# Altium project DMPro16.PrjPcb (part 2 of 3)

## Sheet XC7A35TFTG256_bank35.SchDoc
size A4; DocumentNumber: 20; SheetNumber: 20; SheetTotal: 21; SheetName: FPGA Bank 35
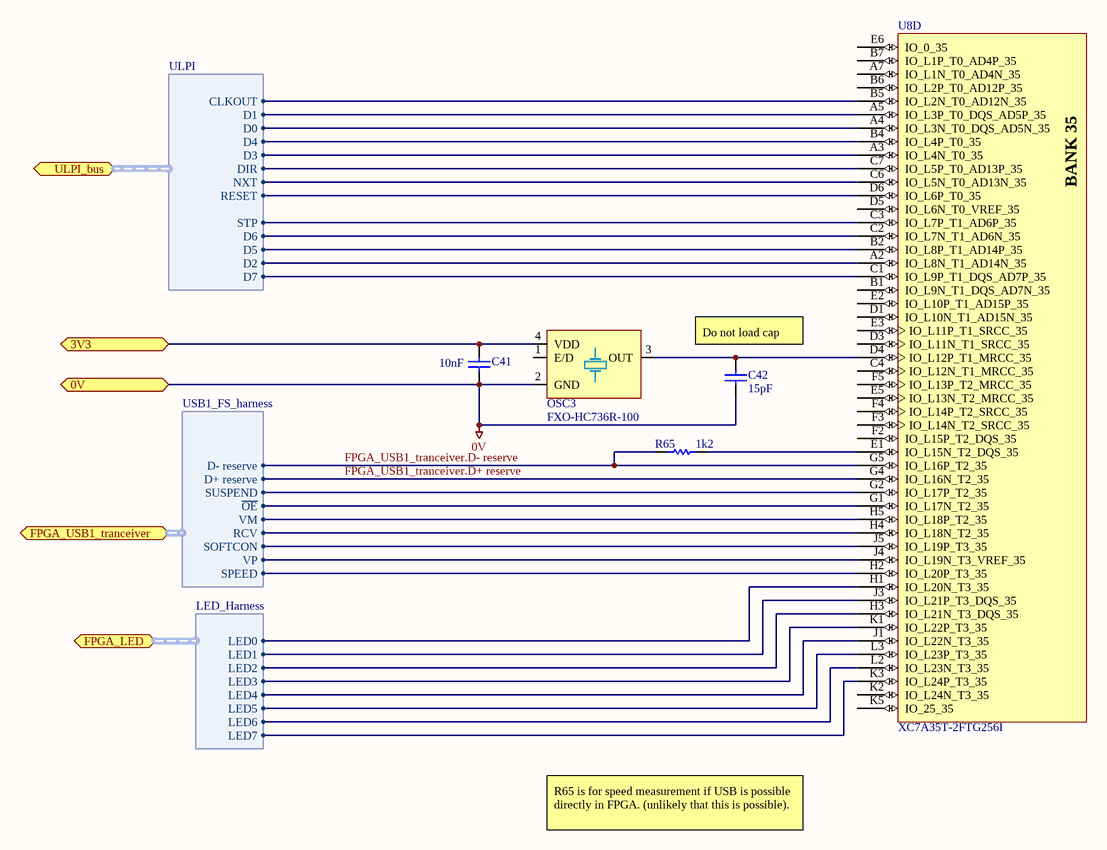
[diagram p12: XC7A35TFTG256_bank35.SchDoc]

### Parts
C41  value 10nF  [CAPC0603(1608)100_L]  (hidden comment: CAP 10nF 16V 0603(1608))
C42  value 15pF  [CAPC0603(1608)100_N]  (hidden comment: CAP 15pF 16V 0603(1608))
OSC3  FXO-HC736R-100  [FXO-HC73]
R65  value 1k2  [RESC0603(1608)_M]  (hidden comment: 1K2 1% 0603(1608))
U8  XC7A35T-2FTG256I  [FTG256]  (part D of 8)

### Ports
0V, 3V3, FPGA_LED (harness LED_Harness), FPGA_USB1_tranceiver (harness USB1_FS_harness), ULPI_bus (harness ULPI)

### Harnesses
ULPI: D0, D1, D2, D3, D4, D5, D6, D7, CLKOUT, STP, DIR, NXT, RESET
LED_Harness: LED0, LED1, LED2, LED3, LED4, LED5, LED6, LED7
USB1_FS_harness: VM, VP, RCV, SOFTCON, SPEED, ~{OE}, SUSPEND, D- reserve, D+ reserve

### Nets
0V: C41.1 C42.1 OSC3.2(GND) ; port 0V
3V3: C41.2 OSC3.4(VDD) ; port 3V3
FPGA_USB1_tranceiver.D+ reserve: U8.G4(IO_L16N_T2_35) ; port FPGA_USB1_tranceiver.D+ reserve
FPGA_USB1_tranceiver.D- reserve: R65.1 U8.G5(IO_L16P_T2_35) ; port FPGA_USB1_tranceiver.D- reserve
FPGA_USB1_tranceiver.~{OE}: U8.G1(IO_L17N_T2_35) ; port FPGA_USB1_tranceiver.~{OE}
FPGA_USB1_tranceiver.RCV: U8.H4(IO_L18N_T2_35) ; port FPGA_USB1_tranceiver.RCV
FPGA_USB1_tranceiver.SOFTCON: U8.J5(IO_L19P_T3_35) ; port FPGA_USB1_tranceiver.SOFTCON
FPGA_USB1_tranceiver.SPEED: U8.H2(IO_L20P_T3_35) ; port FPGA_USB1_tranceiver.SPEED
FPGA_USB1_tranceiver.SUSPEND: U8.G2(IO_L17P_T2_35) ; port FPGA_USB1_tranceiver.SUSPEND
FPGA_USB1_tranceiver.VM: U8.H5(IO_L18P_T2_35) ; port FPGA_USB1_tranceiver.VM
FPGA_USB1_tranceiver.VP: U8.J4(IO_L19N_T3_VREF_35) ; port FPGA_USB1_tranceiver.VP
ULPI_bus.CLKOUT: U8.B5(IO_L2N_T0_AD12N_35) ; port ULPI_bus.CLKOUT
ULPI_bus.D0: U8.A4(IO_L3N_T0_DQS_AD5N_35) ; port ULPI_bus.D0
ULPI_bus.D1: U8.A5(IO_L3P_T0_DQS_AD5P_35) ; port ULPI_bus.D1
ULPI_bus.D2: U8.A2(IO_L8N_T1_AD14N_35) ; port ULPI_bus.D2
ULPI_bus.D3: U8.A3(IO_L4N_T0_35) ; port ULPI_bus.D3
ULPI_bus.D4: U8.B4(IO_L4P_T0_35) ; port ULPI_bus.D4
ULPI_bus.D5: U8.B2(IO_L8P_T1_AD14P_35) ; port ULPI_bus.D5
ULPI_bus.D6: U8.C2(IO_L7N_T1_AD6N_35) ; port ULPI_bus.D6
ULPI_bus.D7: U8.C1(IO_L9P_T1_DQS_AD7P_35) ; port ULPI_bus.D7
ULPI_bus.DIR: U8.C7(IO_L5P_T0_AD13P_35) ; port ULPI_bus.DIR
ULPI_bus.NXT: U8.C6(IO_L5N_T0_AD13N_35) ; port ULPI_bus.NXT
ULPI_bus.RESET: U8.D6(IO_L6P_T0_35) ; port ULPI_bus.RESET
ULPI_bus.STP: U8.C3(IO_L7P_T1_AD6P_35) ; port ULPI_bus.STP
NetC42_2: C42.2 OSC3.3(OUT) U8.D4(IO_L12P_T1_MRCC_35)
NetFPGA_LED0_1: U8.H1(IO_L20N_T3_35) ; port FPGA_LED.LED0
NetFPGA_LED1_1: U8.J3(IO_L21P_T3_DQS_35) ; port FPGA_LED.LED1
NetFPGA_LED2_1: U8.J1(IO_L22N_T3_35) ; port FPGA_LED.LED4
NetFPGA_LED3_1: U8.K1(IO_L22P_T3_35) ; port FPGA_LED.LED3
NetFPGA_LED4_1: U8.K3(IO_L24P_T3_35) ; port FPGA_LED.LED7
NetFPGA_LED5_1: U8.L2(IO_L23N_T3_35) ; port FPGA_LED.LED6
NetFPGA_LED6_1: U8.L3(IO_L23P_T3_35) ; port FPGA_LED.LED5
NetFPGA_LED7_1: U8.H3(IO_L21N_T3_DQS_35) ; port FPGA_LED.LED2
NetR65_2: R65.2 U8.E1(IO_L15N_T2_DQS_35)

Not connected (* = marked no-connect by the designer): OSC3 1(E/D); U8 A7(IO_L1N_T0_AD4N_35) B1(IO_L9N_T1_DQS_AD7N_35) B6(IO_L2P_T0_AD12P_35) B7(IO_L1P_T0_AD4P_35) C4(IO_L12N_T1_MRCC_35) D1(IO_L10N_T1_AD15N_35) D3(IO_L11N_T1_SRCC_35) D5(IO_L6N_T0_VREF_35) E2(IO_L10P_T1_AD15P_35) E3(IO_L11P_T1_SRCC_35) E5(IO_L13N_T2_MRCC_35) E6(IO_0_35) F2(IO_L15P_T2_DQS_35) F3(IO_L14N_T2_SRCC_35) F4(IO_L14P_T2_SRCC_35) F5(IO_L13P_T2_MRCC_35) K2(IO_L24N_T3_35) K5(IO_25_35)

### Notes on the sheet
- (near C42) Do not load cap
- R65 is for speed measurement if USB is possible directly in FPGA. (unlikely that this is possible).
- Board:
- Version:
- Sheetname:
- Subject:
- Group:
- Sheet
- of
- Shematic file:
- (in symbol CMP-0383-00025-1, part D) BANK 35

### Library data of the parts
C41 = CMP-1035-02309-1: as C1 on sheet EFM32_IO; Rated Voltage: 16 V; Technology: SMT; Max Thickness: 1 mm
C42 = CMP-1035-00665-1: as C2 on sheet EFM32_IO; Technology: SMT; Max Thickness: 1 mm; Rated Voltage: 16 V
R65 = CMP-1012-00518-1: 1K2 0.1W 1% 0603 (1608 Metric)  SMD; Case-EIA: 0603; Case-Metric: 1608; Power: 0.1 W; Technology: SMT; Tolerance: 1 %
U8 = CMP-0383-00025-1: Artix-7 FPGA, 170 User I/Os, 0 GTP, 256-Ball BGA, Speed Grade 2, Industrial Grade, Pb-Free; Manufacturer: Xilinx; Logic Cells: 33280; GTP: 0; CMTs: 5; Available User I/O: 170; Total Block RAM: 1800 Kb; Speed Grades: 2; ComponentLink3Description: Pinout; ComponentLink4Description: Package Specification; ComponentLink2URL: http://www.xilinx.com/support/documentation/data_sheets/ds180_7Series_Overview.pdf; DatasheetVersion: Rev. 1.15; PackageVersion: Rev. 1.11; ComponentLink3URL: http://www.xilinx.com/support/documentation/user_guides/ug475_7Series_Pkg_Pinout.pdf; ComponentLink1Description: Manufacturer URL; PackageReference: FTG-256; ComponentLink1URL: http://www.xilinx.com/; ComponentLink4URL: http://www.xilinx.com/support/documentation/user_guides/ug475_7Series_Pkg_Pinout.pdf; Mounting Technology: Surface Mount; Maximum Distributed RAM: 400 Kb; PackageDescription: 256-Ball Wire-Bond Fine-Pitch Thin BGA, Body 17 x 17 mm, Pitch 1 mm; ComponentLink2Description: Datasheet; Operating Temperature Range: Industrial; PartNumber: XC7A35T-2FTG256I; PartId: 1
OSC3 = FXO-HC736R-100: Supplier 1: Digi-Key; Supplier Part Number 1: 631-1176-1-ND

## Sheet SDtop.SchDoc
size A4; DocumentNumber: 9; SheetNumber: 9; SheetTotal: 21; SheetName: SD Card
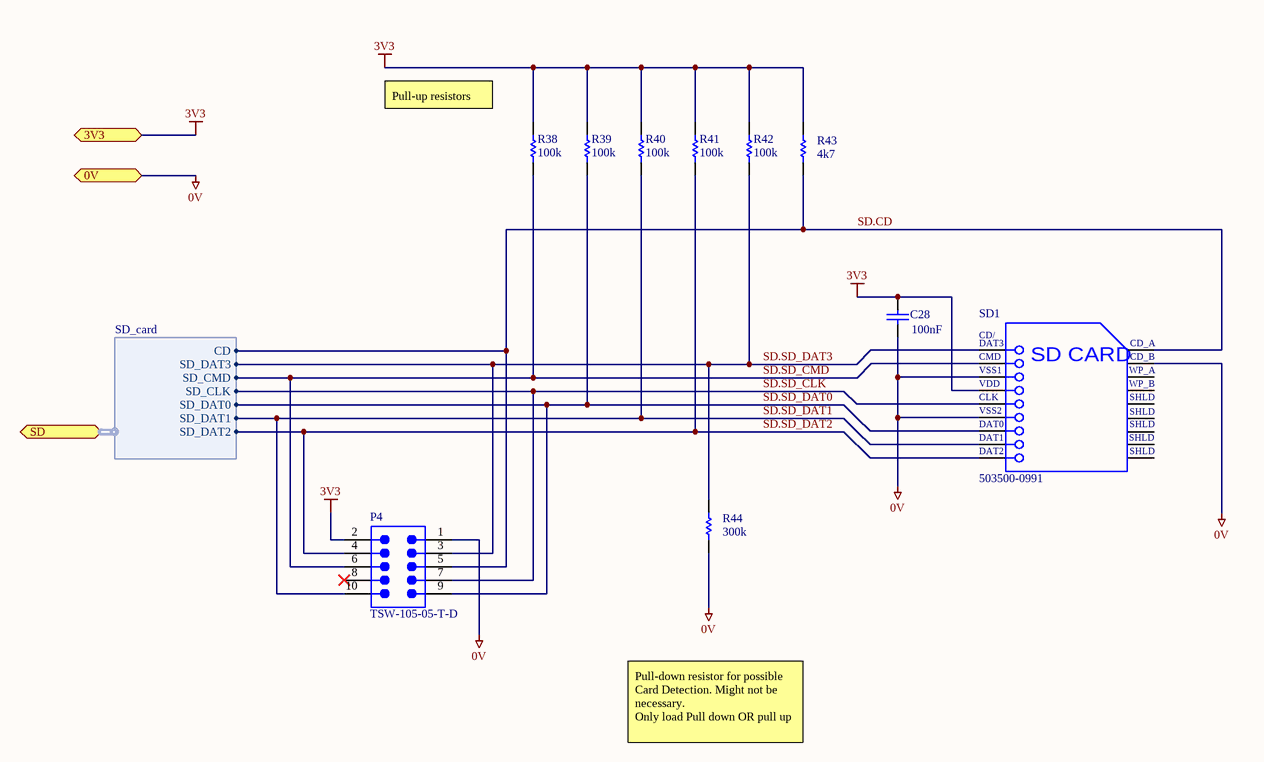
[diagram p13: SDtop.SchDoc]

### Parts
C28  value 100nF  [CAPC0603(1608)100_M]  (hidden comment: CAP 100nF 16V 0603(1608))
P4  TSW-105-05-T-D  [SMTC-TSW-105-05-X-D]
R38  value 100k  [RESC0603(1608)_N]  (hidden comment: 100K 1% 0603(1608))
R39  value 100k  [RESC0603(1608)_N]  (hidden comment: 100K 1% 0603(1608))
R40  value 100k  [RESC0603(1608)_N]  (hidden comment: 100K 1% 0603(1608))
R41  value 100k  [RESC0603(1608)_N]  (hidden comment: 100K 1% 0603(1608))
R42  value 100k  [RESC0603(1608)_N]  (hidden comment: 100K 1% 0603(1608))
R43  value 4k7  [RESC0603(1608)_N]  (hidden comment: 4K7 1% 0603(1608))
R44  value 300k  [RESC0603(1608)_M]  (hidden comment: 300K 1% 0603(1608))
SD1  503500-0991  [MOLX-503500-0991_V]

### Ports
0V, 3V3, SD (harness SD_card)

### Harnesses
SD_card: SD_CMD, SD_CLK, SD_DAT0, SD_DAT1, SD_DAT2, SD_DAT3, CD

### Nets
0V: C28.1 P4.1 R44.1 SD1.3(VSS1) SD1.6(VSS2) SD1.11(CD_B) ; port 0V
3V3: C28.2 P4.2 R38.2 R39.2 R40.2 R41.2 R42.2 R43.2 SD1.4(VDD) ; port 3V3
SD.CD: P4.5 R43.1 SD1.10(CD_A) ; port SD.CD
SD.SD_CLK: P4.7 SD1.5(CLK) ; port SD.SD_CLK
SD.SD_CMD: P4.6 R38.1 SD1.2(CMD) ; port SD.SD_CMD
SD.SD_DAT0: P4.9 R39.1 SD1.7(DAT0) ; port SD.SD_DAT0
SD.SD_DAT1: P4.10 R40.1 SD1.8(DAT1) ; port SD.SD_DAT1
SD.SD_DAT2: P4.4 R41.1 SD1.9(DAT2) ; port SD.SD_DAT2
SD.SD_DAT3: P4.3 R42.1 R44.2 SD1.1(CD/DAT3) ; port SD.SD_DAT3

Not connected (* = marked no-connect by the designer): P4 8*; SD1 12(WP_A) 13(WP_B) 14(SHLD1) 15(SHLD2) 16(SHLD3) 17(SHLD4) 18(SHLD5)

### Notes on the sheet
- (near R38) Pull-up resistors
- Pull-down resistor for possible Card Detection. Might not be necessary.
  Only load Pull down OR pull up
- Board:
- Version:
- Sheetname:
- Subject:
- Group:
- Sheet
- of
- Shematic file:
- (in symbol CMP-1676-00006-1) CD/; DAT3; SD CARD; SHLD

### Library data of the parts
C28 = CMP-1035-02583-1: as C6 on sheet EFM32_power; Rated Voltage: 16 V; Max Thickness: 1 mm; Technology: SMT
P4 = CMP-1024-00361-1: Manufacturer: Samtec; Pitch: 2.54 mm; PackageReference: TSW-105-05-X-D; ComponentLink2Description: Datasheet; ComponentLink1URL: http://www.samtec.com; PackageVersion: DM, 8/1988; Orientation: Vertical; RoHS: True; ComponentLink3Description: Package Specification; PartNumber: TSW-105-05-T-D; Temperature Range: -55 to 105 degC; DatasheetVersion: F-214; PackageDescription: .025[0.64] SQ. Post Terminal Strip Assembly; ComponentLink1Description: Manufacturer URL; Mounting Technology: Through-hole; ComponentLink2URL: http://www.samtec.com/documents/webfiles/pdf/TSW_TH.PDF; ComponentLink3URL: http://www.samtec.com/documents/webfiles/cpdf/TSW-XXX-XX-XXX-X-XX-XXX-MKT.pdf
R38-R42 = CMP-1012-00736-1: 100K 0.1W 1% 0603 (1608 Metric)  SMD; Case-Metric: 1608; Case-EIA: 0603; Power: 0.1 W; Tolerance: 1 %; Technology: SMT
R43 = CMP-1012-00586-1: 4K7 0.1W 1% 0603 (1608 Metric)  SMD; Case-EIA: 0603; Case-Metric: 1608; Power: 0.1 W; Tolerance: 1 %; Technology: SMT
R44 = CMP-1012-00788-1: 300K 0.1W 1% 0603 (1608 Metric)  SMD; Case-Metric: 1608; Case-EIA: 0603; Technology: SMT; Power: 0.1 W; Tolerance: 1 %
SD1 = CMP-1676-00006-1: SD and Combo Memory Card Connector, 9 Position Surface Mount, -25 to 85 degC, RoHS, Tape and Reel; Nominal Supply Current: 3 mA; Max Supply Voltage: 5.5 V; Output Current: 5 mA; Min Supply Voltage: 2.5 V; Case\Package: Axial; Pins: 3; ComponentLink2Description: Datasheet; REACH SVHC: Unknown; RoHSCompliant: true; Height: 6.95 mm; Max Operating Temperature: 85 degC; ComponentLink2URL: http://www.molex.com/pdm_docs/sd/5035000991_sd.pdf; PackageDescription: SD Card Connector, 9 Position Surface Mount, Length 28.6 mm, Height 3.1 mm; ComponentLink1URL: http://www.molex.com/; Mount: Through Hole; Packaging: Bulk; Width: 4.8 mm; Length: 5 mm; PackageReference: 503500-0991; ComponentLink1Description: Manufacturer URL; DatasheetVersion: Rev. B, 02/2010; Radiation Hardening: No; Package Quantity: 1500; Min Operating Temperature: -25 degC

## Sheet Power.SchDoc
size A4; DocumentNumber: 8; SheetNumber: 8; SheetTotal: 21; SheetName: Power Regulators
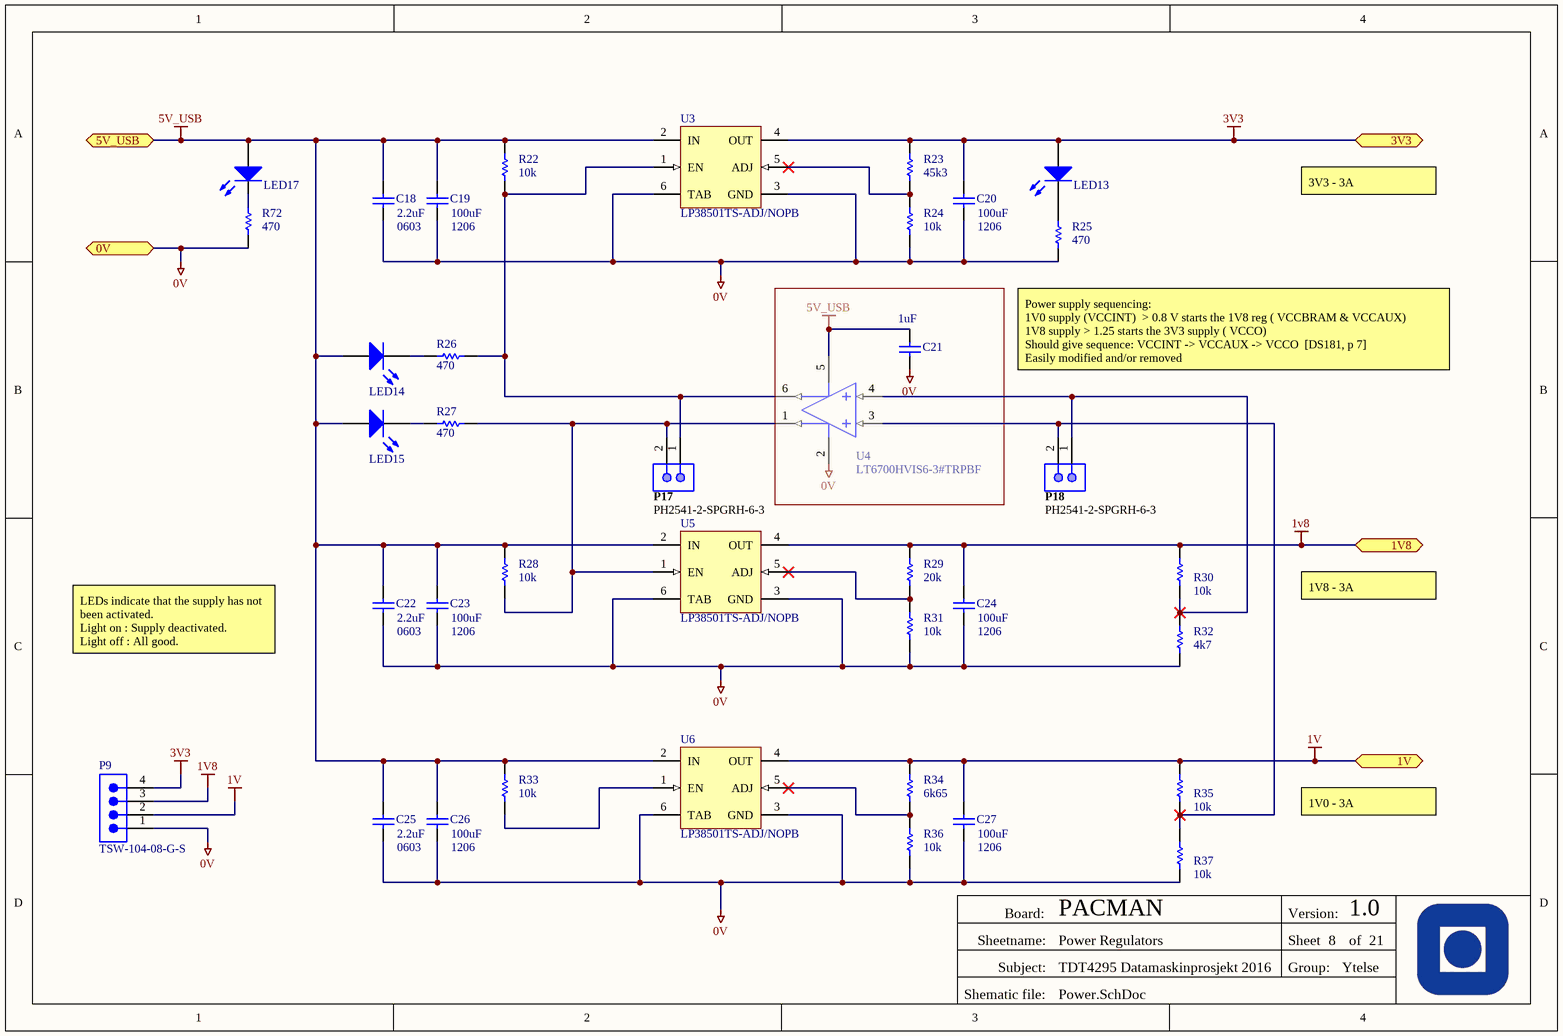
[diagram p14: Power.SchDoc]

### Parts
C18  value 2.2uF  Case-EIA: 0603  [CAPC0603(1608)55_N]  (hidden comment: CAP 2.2uF 16V 0603(1608))
C19  value 100uF  Case-EIA: 1206  [CAPC1206(3216)190_L]  (hidden comment: CAP 100uF 10V 1206(3216))
C20  value 100uF  Case-EIA: 1206  [CAPC1206(3216)190_L]  (hidden comment: CAP 100uF 10V 1206(3216))
C21  value 1uF  [CAPC0603(1608)100_N]  (hidden comment: CAP 1uF 16V 0603(1608))
C22  value 2.2uF  Case-EIA: 0603  [CAPC0603(1608)55_N]  (hidden comment: CAP 2.2uF 16V 0603(1608))
C23  value 100uF  Case-EIA: 1206  [CAPC1206(3216)190_L]  (hidden comment: CAP 100uF 10V 1206(3216))
C24  value 100uF  Case-EIA: 1206  [CAPC1206(3216)190_L]  (hidden comment: CAP 100uF 10V 1206(3216))
C25  value 2.2uF  Case-EIA: 0603  [CAPC0603(1608)55_N]  (hidden comment: CAP 2.2uF 16V 0603(1608))
C26  value 100uF  Case-EIA: 1206  [CAPC1206(3216)190_L]  (hidden comment: CAP 100uF 10V 1206(3216))
C27  value 100uF  Case-EIA: 1206  [CAPC1206(3216)190_L]  (hidden comment: CAP 100uF 10V 1206(3216))
LED13  150060RS75000  [0603_A]  (value not drawn)
LED14  150060RS75000  [0603_A]  (value not drawn)
LED15  150060RS75000  [0603_A]  (value not drawn)
LED17  150060RS75000  [0603_A]  (value not drawn)
P9  TSW-104-08-G-S  [SMTC-TSW-104-08-X-S]
P17  PH2541-2-SPGRH-6-3  [PH2541-2-SPGRH-6-3_V]
P18  PH2541-2-SPGRH-6-3  [PH2541-2-SPGRH-6-3_V]
R22  value 10k  [RESC0603(1608)_N]  (hidden comment: 10K 1% 0603(1608))
R23  value 45k3  [RESC0603(1608)_N]  (hidden comment: 45K3 1% 0603(1608))
R24  value 10k  [RESC0603(1608)_N]  (hidden comment: 10K 1% 0603(1608))
R25  value 470  [RESC0603(1608)_N]  (hidden comment: 470R 5% 0603(1608))
R26  value 470  [RESC0603(1608)_N]  (hidden comment: 470R 5% 0603(1608))
R27  value 470  [RESC0603(1608)_N]  (hidden comment: 470R 5% 0603(1608))
R28  value 10k  [RESC0603(1608)_N]  (hidden comment: 10K 1% 0603(1608))
R29  value 20k  [RESC0603(1608)_L]  (hidden comment: 20K 1% 0603(1608))
R30  value 10k  [RESC0603(1608)_N]  (hidden comment: 10K 5% 0603(1608))
R31  value 10k  [RESC0603(1608)_N]  (hidden comment: 10K 1% 0603(1608))
R32  value 4k7  [RESC0603(1608)_N]  (hidden comment: 4K7 5% 0603(1608))
R33  value 10k  [RESC0603(1608)_N]  (hidden comment: 10K 1% 0603(1608))
R34  value 6k65  [RESC0603(1608)_M]  (hidden comment: 6K65 1% 0603(1608))
R35  value 10k  [RESC0603(1608)_N]  (hidden comment: 10K 5% 0603(1608))
R36  value 10k  [RESC0603(1608)_N]  (hidden comment: 10K 1% 0603(1608))
R37  value 10k  [RESC0603(1608)_N]  (hidden comment: 10K 5% 0603(1608))
R72  value 470  [RESC0603(1608)_N]  (hidden comment: 470R 5% 0603(1608))
U3  LP38501TS-ADJ/NOPB  [TS5B_N]
U4  LT6700HVIS6-3#TRPBF  [LT-S6_M]
U5  LP38501TS-ADJ/NOPB  [TS5B_N]
U6  LP38501TS-ADJ/NOPB  [TS5B_N]

### Ports
0V, 1V, 1V8, 3V3, 5V_USB

### Nets
0V: C18.1 C19.1 C20.1 C21.1 C22.1 C23.1 C24.1 C25.1 C26.1 C27.1 P9.1 R24.1 R25.1 R31.1 R32.1 R36.1 R37.1 R72.1 U3.3(GND) U3.6(TAB) U4.2(GND) U5.3(GND) U5.6(TAB) U6.3(GND) U6.6(TAB) ; port 0V
1V: C27.2 P9.2 R34.2 R35.2 U6.4(OUT) ; port 1V
1V8: C24.2 P9.3 R29.2 R30.2 U5.4(OUT) ; port 1V8
3V3: C20.2 LED13.2(A) P9.4 R23.2 U3.4(OUT) ; port 3V3
5V_USB: C18.2 C19.2 C21.2 C22.2 C23.2 C25.2 C26.2 LED14.2(A) LED15.2(A) LED17.2(A) R22.2 R28.2 R33.2 U3.2(IN) U4.5(VS) U5.2(IN) U6.2(IN) ; port 5V_USB
NetLED13_1: LED13.1(K) R25.2
NetLED14_1: LED14.1(K) R26.1
NetLED15_1: LED15.1(K) R27.1
NetLED17_1: LED17.1(K) R72.2
NetP17_1: P17.1 R22.1 R26.2 U3.1(EN) U4.6(OUTB)
NetP17_2: P17.2 R27.2 R28.1 U4.1(OUTA) U5.1(EN)
NetP18_1: P18.1 R30.1 R32.2 U4.4(+INB)
NetP18_2: P18.2 R35.1 R37.2 U4.3(+INA)
NetR23_1: R23.1 R24.2 U3.5(ADJ)
NetR29_1: R29.1 R31.2 U5.5(ADJ)
NetR33_1: R33.1 U6.1(EN)
NetR34_1: R34.1 R36.2 U6.5(ADJ)

### Notes on the sheet
- 3V3 - 3A
- (near R25) Power supply sequencing:
  1V0 supply (VCCINT)  > 0.8 V starts the 1V8 reg ( VCCBRAM & VCCAUX)
  1V8 supply > 1.25 starts the 3V3 supply ( VCCO)
  Should give sequence: VCCINT -> VCCAUX -> VCCO  [DS181, p 7]
  Easily modified and/or removed
- LEDs indicate that the supply has not been activated.
  Light on : Supply deactivated.
  Light off : All good.
- 1V8 - 3A
- 1V0 - 3A
- Board:
- Version:
- Sheetname:
- Subject:
- Group:
- Sheet
- of
- Shematic file:

### Library data of the parts
C18 C22 C25 = CMP-1035-02762-1: CAP 2.2uF 16V ±10% 0603 (1608 Metric) Thickness 0.55mm SMD; Tolerance: Â±10%; Case-Metric: 1608; Max Thickness: 0.55 mm; Technology: SMT; Rated Voltage: 16 V
C19 C20 C23 C24 C26 C27 = CMP-1037-05006-1: CAP 100uF 10V ±20% 1206 (3216 Metric) Thickness 1.9mm SMD; Tolerance: Â±20%; Case-Metric: 3216; Max Thickness: 1.9 mm; Technology: SMT; Rated Voltage: 10 V
C21 = CMP-1035-02736-1: as C4 on sheet EFM32_power; Technology: SMT; Max Thickness: 1 mm; Rated Voltage: 16 V
LED13-LED15 LED17 = CMP-1426-00001-1: as LED16 on sheet XC7A35TFTG256_bank0; Color: Red; PackageReference: 0603_A; ComponentLink2URL: http://katalog.we-online.com/led/datasheet/150060RS75000.pdf; ComponentLink1URL: http://www.we-online.com; ComponentLink1Description: Manufacturer URL; ComponentLink2Description: Datasheet; PartNumber: 150060RS75000
P9 = CMP-1024-00357-1: as P16 on sheet XC7A35TFTG256_bank15; RoHS: True; ComponentLink3URL: http://www.samtec.com/documents/webfiles/cpdf/TSW-XXX-XX-XXX-X-XX-XXX-MKT.pdf; Mounting Technology: Through-hole; ComponentLink2URL: http://www.samtec.com/documents/webfiles/pdf/TSW_TH.PDF; ComponentLink1URL: http://www.samtec.com; ComponentLink3Description: Package Specification; PackageVersion: DM, 8/1988; ComponentLink2Description: Datasheet; PackageReference: TSW-104-08-X-S; PackageDescription: .025[0.64] SQ. Post Terminal Strip Assembly; PartNumber: TSW-104-08-G-S; ComponentLink1Description: Manufacturer URL; Temperature Range: -55 to 125 degC; DatasheetVersion: F-214; Orientation: Vertical
P17 P18 = CMP-0261-00001-1: Male Header, Pitch 2.54mm, 2x1 Position, Mated Height 6mm, Tail Length 3mm; PackageDescription: 2-Pin Male Header IDC, 2.54 x 5.08 mm Body, 2.54 mm Pitch; PartNumber: PH2541-2-SPGRH-6-3; ComponentLink1URL: http://www.suzhoupinchao.com/; Mounting Technology: Through Hole; ComponentLink1Description: Manufacturer URL; PackageReference: PH2541-2-SPGRH-6-3
R22 R24 R28 R31 R33 R36 = CMP-1012-00623-1: 10K 0.1W 1% 0603 (1608 Metric)  SMD; Case-EIA: 0603; Case-Metric: 1608; Power: 0.1 W; Tolerance: 1 %; Technology: SMT
R23 = CMP-1012-00697-1: 45K3 0.1W 1% 0603 (1608 Metric)  SMD; Case-EIA: 0603; Case-Metric: 1608; Power: 0.1 W; Technology: SMT; Tolerance: 1 %
R25-R27 R72 = CMP-1012-00066-1: 470R 0.1W 5% 0603 (1608 Metric)  SMD; Case-Metric: 1608; Case-EIA: 0603; Tolerance: 5 %; Technology: SMT; Power: 0.1 W
R29 = CMP-1012-00655-1: 20K 0.1W 1% 0603 (1608 Metric)  SMD; Case-Metric: 1608; Case-EIA: 0603; Technology: SMT; Tolerance: 1 %; Power: 0.1 W
R30 R35 R37 = CMP-1012-00098-1: 10K 0.1W 5% 0603 (1608 Metric)  SMD; Case-EIA: 0603; Case-Metric: 1608; Technology: SMT; Tolerance: 5 %; Power: 0.1 W
R32 = CMP-1012-00090-1: 4K7 0.1W 5% 0603 (1608 Metric)  SMD; Case-Metric: 1608; Case-EIA: 0603; Tolerance: 5 %; Technology: SMT; Power: 0.1 W
R34 = CMP-1012-00603-1: 6K65 0.1W 1% 0603 (1608 Metric)  SMD; Case-EIA: 0603; Case-Metric: 1608; Tolerance: 1 %; Technology: SMT; Power: 0.1 W
U3 U5 U6 = CMP-0062-00224-1: 3A FlexCap Low Dropout Linear Regulator for 2.7V to 5.5V Inputs, 5-pin TO-263, Pb-Free; Manufacturer: National Semiconductor; PackageTopMarking: NSUZXYTTE#*LP38501*TS-ADJ; PowerWise: N; CompType: LDO IC; Code_JEDEC: MO-169-AB; DatasheetVersion: May-2008; PackageReference: TS5B; PackageDescription: TO-263, Molded, .400 x .390 x .180in, 5 Lead, .067in Pitch, Surface Mount; RoHS: Y; PinCount: 5; PackageVersion: revD, Apr-2005
U4 = CMP-0360-00441-2: Micropower, Low Voltage, Comparator with 400 mV Reference, 2 Channels, 1.4 to 36 V, -40 to +85 degC, 6-pin TSOT-23 (S6), Tape and Reel; Manufacturer: Linear Technology; Generic Part Number: LT6700HV-3; Supply Current (uA) Guaranteed: 10; Vs Max (V): 36; Prop Delay (us): 18; Vs Min (V): 1.4; Supply Current (uA) Typical: 5.7; Vos (mV) Typical: 6; Channels (#): 2; ComponentLink2Description: Datasheet; ComponentLink3Description: Package Specification; PackageDescription: 6-Pin Plastic TSOT-23, Body 2.9 x 1.63 mm, Pitch 0.95 mm; RoHS: Y; ComponentLink2URL: http://cds.linear.com/docs/en/datasheet/6700123fg.pdf; ComponentLink3URL: http://cds.linear.com/docs/en/packaging/SOT_6_05-08-1636.pdf; Mounting Technology: Surface Mount; PartNumber: LT6700HVIS6-3#TRPBF; Code_JEDEC: MO-193; ComponentLink1URL: http://www.linear.com/; PackageReference: S6; DatasheetVersion: Rev G; Supply Voltage Range: 1.4 to 36 V; Features: Comparator, Reference, Over-the-Top Inputs; ComponentLink1Description: Manufacturer URL

## Sheet N25Q128A13ESE40.SchDoc
size A4; DocumentNumber: 7; SheetNumber: 7; SheetTotal: 21; SheetName: Configuration Memory
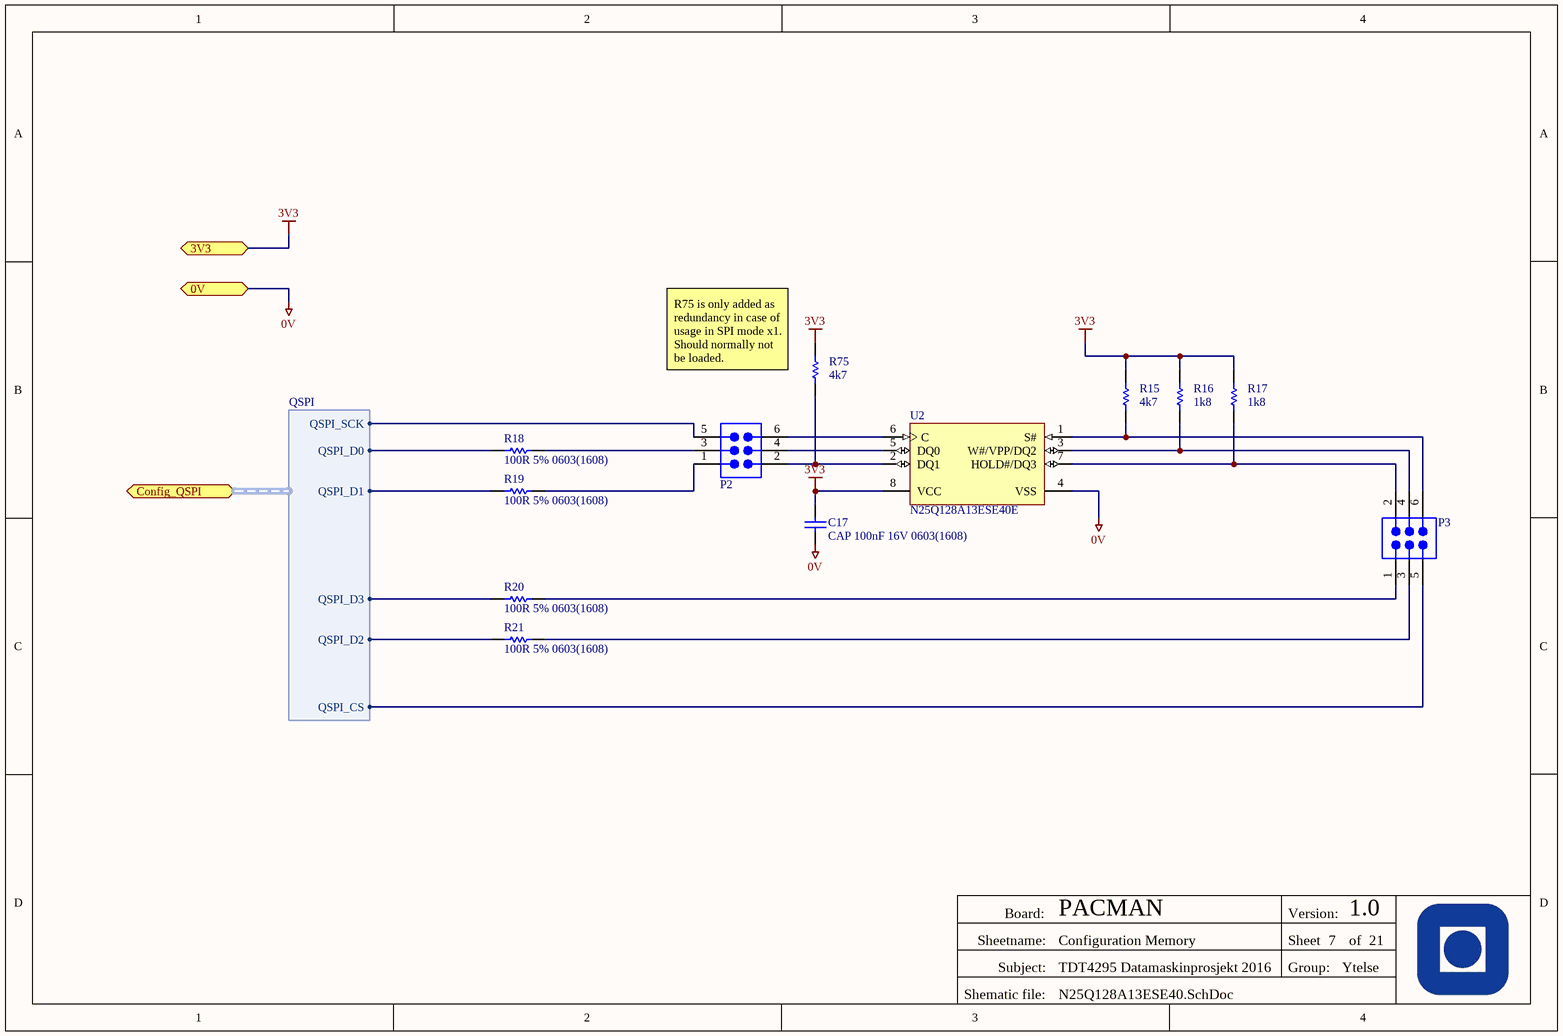
[diagram p15: N25Q128A13ESE40.SchDoc]

### Parts
C17  CAP 100nF 16V 0603(1608)  [CAPC0603(1608)100_M]
P2  TSW-103-08-T-D  [SMTC-TSW-103-08-X-D]  (value not drawn)
P3  TSW-103-08-T-D  [SMTC-TSW-103-08-X-D]  (value not drawn)
R15  value 4k7  [RESC0603(1608)_M]  (hidden comment: 4K7 5% 0603(1608))
R16  value 1k8  [RESC0603(1608)_M]  (hidden comment: 1K8 5% 0603(1608))
R17  value 1k8  [RESC0603(1608)_M]  (hidden comment: 1K8 5% 0603(1608))
R18  100R 5% 0603(1608)  [RESC0603(1608)_M]
R19  100R 5% 0603(1608)  [RESC0603(1608)_M]
R20  100R 5% 0603(1608)  [RESC0603(1608)_M]
R21  100R 5% 0603(1608)  [RESC0603(1608)_M]
R75  value 4k7  [RESC0603(1608)_M]  (hidden comment: 4K7 5% 0603(1608))
U2  N25Q128A13ESE40E  [MICT-SE-8_N]

### Ports
0V, 3V3, Config_QSPI (harness QSPI)

### Harnesses
QSPI: QSPI_D0, QSPI_D1, QSPI_D2, QSPI_D3, QSPI_SCK, QSPI_CS

### Nets
0V: C17.1 U2.4(VSS) ; port 0V
3V3: C17.2 R15.2 R16.2 R17.2 R75.2 U2.8(VCC) ; port 3V3
Config_QSPI.QSPI_CS: P3.5 ; port Config_QSPI.QSPI_CS
Config_QSPI.QSPI_D0: R18.2 ; port Config_QSPI.QSPI_D0
Config_QSPI.QSPI_D1: R19.2 ; port Config_QSPI.QSPI_D1
Config_QSPI.QSPI_D2: R21.2 ; port Config_QSPI.QSPI_D2
Config_QSPI.QSPI_D3: R20.2 ; port Config_QSPI.QSPI_D3
Config_QSPI.QSPI_SCK: P2.5 ; port Config_QSPI.QSPI_SCK
NetP2_1: P2.1 R19.1
NetP2_2: P2.2 R75.1 U2.2(DQ1)
NetP2_3: P2.3 R18.1
NetP2_4: P2.4 U2.5(DQ0)
NetP2_6: P2.6 U2.6(C)
NetP3_1: P3.1 R20.1
NetP3_2: P3.2 R17.1 U2.7(HOLD#/DQ3)
NetP3_3: P3.3 R21.1
NetP3_4: P3.4 R16.1 U2.3(W#/VPP/DQ2)
NetP3_6: P3.6 R15.1 U2.1(S#)

### Notes on the sheet
- (near R75) R75 is only added as redundancy in case of usage in SPI mode x1. Should normally not be loaded.
- Board:
- Version:
- Sheetname:
- Subject:
- Group:
- Sheet
- of
- Shematic file:

### Library data of the parts
C17 = CMP-1035-02583-1: CAP 100nF 16V ±5% 0603 (1608 Metric) Thickness 1mm SMD; Tolerance: Â±5%; Case-Metric: 1608; Case-EIA: 0603; Rated Voltage: 16 V; Max Thickness: 1 mm; Technology: SMT; Value: 100nF
P2 P3 = CMP-1024-00335-1: 0.025" SQ Post Header, Through-hole, Vertical, -55 to 105 degC, 2.54 mm Pitch, 6-Pin, Male, RoHS; Manufacturer: Samtec; Pitch: 2.54 mm; PackageDescription: .025[0.64] SQ. Post Terminal Strip Assembly; DatasheetVersion: F-214; ComponentLink3Description: Package Specification; Mounting Technology: Through-hole; ComponentLink1URL: http://www.samtec.com; ComponentLink2URL: http://www.samtec.com/documents/webfiles/pdf/TSW_TH.PDF; PartNumber: TSW-103-08-T-D; ComponentLink1Description: Manufacturer URL; Temperature Range: -55 to 105 degC; ComponentLink2Description: Datasheet; PackageVersion: DM, 8/1988; RoHS: True; ComponentLink3URL: http://www.samtec.com/documents/webfiles/cpdf/TSW-XXX-XX-XXX-X-XX-XXX-MKT.pdf; Orientation: Vertical; PackageReference: TSW-103-08-X-D
R15 R75 = CMP-1012-00090-1: 4K7 0.1W 5% 0603 (1608 Metric)  SMD; Case-Metric: 1608; Case-EIA: 0603; Tolerance: 5 %; Technology: SMT; Power: 0.1 W
R16 R17 = CMP-1012-00080-1: 1K8 0.1W 5% 0603 (1608 Metric)  SMD; Case-Metric: 1608; Case-EIA: 0603; Tolerance: 5 %; Power: 0.1 W; Technology: SMT
R18-R21 = CMP-1012-00050-1: 100R 0.1W 5% 0603 (1608 Metric)  SMD; Case-EIA: 0603; Value: 100.00 Ohm; Case-Metric: 1608; Tolerance: 5 %; Technology: SMT; Power: 0.1 W
U2 = CMP-0357-00158-1: 128 Mb (x1/x2/x4) Serial NOR Flash Memory with Multi I/O, 108 MHz, 2.7 to 3.6 V, 8-pin SO8 Wide (SE), Tray; Part Family: N25QÂ; Manufacturer: Micron; Density: 128MbÂ; Speed: 108 MHzÂ; Voltage: 2.7V-3.6VÂ; ComponentLink1URL: http://www.micron.com/; Mounting Technology: Surface Mount; ComponentLink1Description: Manufacturer URL; DatasheetVersion: Rev. L; Type: Multi I/OÂ; ComponentLink3Description: Package Specification; Applications: EmbeddedÂ; ComponentLink3URL: http://www.micron.com/~/media/Documents/Products/Data%20Sheet/NOR%20Flash/Serial%20NOR/N25Q/n25q_32mb_1_8v_65nm.pdf; PackageDescription: 8-Pin SO Wide, 5.29 X 5.29 mm, Pitch 1.27 mm; RoHS: YesÂ; Width: x1/x2/x4Â; PartNumber: N25Q128A13ESE40E; PackageVersion: Rev. E; PackageReference: MICT-SE-8; ComponentLink2Description: Datasheet; Part Status: ProductionÂ; Package: SO8 WideÂ; ComponentLink2URL: http://www.micron.com/~/media/Documents/Products/Data%20Sheet/NOR%20Flash/Serial%20NOR/N25Q/n25q_128mb_3v_65nm.pdf

## Sheet USB3300.SchDoc
size A4; DocumentNumber: 12; SheetNumber: 12; SheetTotal: 21; SheetName: USB 2.0 HS PHY
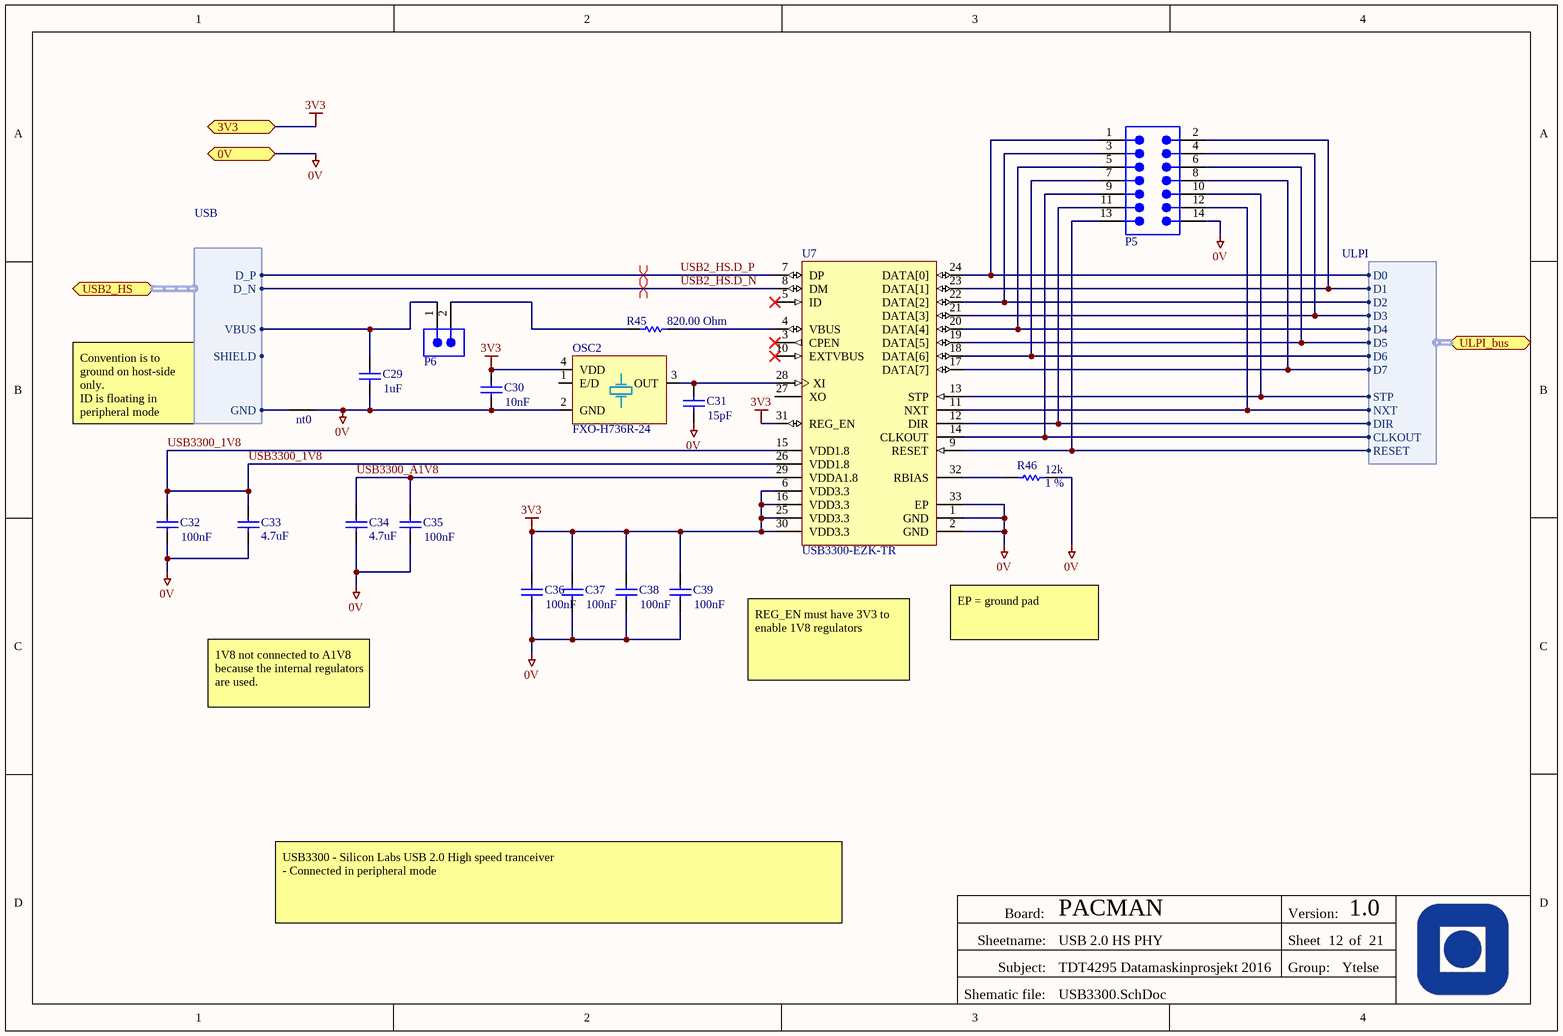
[diagram p16: USB3300.SchDoc]

### Parts
C29  value 1uF  [CAPC0603(1608)100_M]  (hidden comment: CAP 1uF 16V 0603(1608))
C30  value 10nF  [CAPC0603(1608)100_L]  (hidden comment: CAP 10nF 16V 0603(1608))
C31  value 15pF  [CAPC0603(1608)100_M]  (hidden comment: CAP 15pF 16V 0603(1608))
C32  value 100nF  [CAPC0603(1608)100_M]  (hidden comment: CAP 100nF 16V 0603(1608))
C33  value 4.7uF  [CAPC0603(1608)100_M]  (hidden comment: CAP 4.7uF 16V 0603(1608))
C34  value 4.7uF  [CAPC0603(1608)100_M]  (hidden comment: CAP 4.7uF 16V 0603(1608))
C35  value 100nF  [CAPC0603(1608)100_M]  (hidden comment: CAP 100nF 16V 0603(1608))
C36  value 100nF  [CAPC0603(1608)100_M]  (hidden comment: CAP 100nF 16V 0603(1608))
C37  value 100nF  [CAPC0603(1608)100_M]  (hidden comment: CAP 100nF 16V 0603(1608))
C38  value 100nF  [CAPC0603(1608)100_M]  (hidden comment: CAP 100nF 16V 0603(1608))
C39  value 100nF  [CAPC0603(1608)100_M]  (hidden comment: CAP 100nF 16V 0603(1608))
nt0  net tie  [net tie]  (value not drawn)  (net tie, no BOM)
OSC2  FXO-H736R-24  [FXO-HC73]
P5  HTSW-107-42-F-D  [SMTC-HTSW-107-42-X-D]  (value not drawn)
P6  TSW-102-26-L-S  [SMTC-TSW-102-26-XX-S]  (value not drawn)
R45  value 820.00 Ohm  [RESC0603(1608)_N]  (hidden comment: 820R 5% 0603(1608))
R46  value 12k  Tolerance: 1 %  [RESC0603(1608)_L]  (hidden comment: 12K 1% 0603(1608))
U7  USB3300-EZK-TR  [MCHP-QFN-32-5x5_V2]

### Ports
0V, 3V3, ULPI_bus (harness ULPI), USB2_HS (harness USB)

### Harnesses
ULPI: D0, D1, D2, D3, D4, D5, D6, D7, CLKOUT, STP, DIR, NXT, RESET
USB: D_P, D_N, VBUS, GND, SHIELD

### Nets
0V: C29.1 C30.1 C31.1 C32.1 C33.1 C34.1 C35.1 C36.1 C37.1 C38.1 C39.1 nt0.1 OSC2.2(GND) P5.14 R46.2 U7.1(GND) U7.2(GND) U7.33(EP) ; port 0V
3V3: C30.2 C36.2 C37.2 C38.2 C39.2 OSC2.4(VDD) U7.6(VDD3.3) U7.16(VDD3.3) U7.25(VDD3.3) U7.30(VDD3.3) U7.31(REG_EN) ; port 3V3
ULPI_bus.CLKOUT: P5.9 U7.14(CLKOUT) ; port ULPI_bus.CLKOUT
ULPI_bus.D0: P5.1 U7.24(DATA[0]) ; port ULPI_bus.D0
ULPI_bus.D1: P5.2 U7.23(DATA[1]) ; port ULPI_bus.D1
ULPI_bus.D2: P5.3 U7.22(DATA[2]) ; port ULPI_bus.D2
ULPI_bus.D3: P5.4 U7.21(DATA[3]) ; port ULPI_bus.D3
ULPI_bus.D4: P5.5 U7.20(DATA[4]) ; port ULPI_bus.D4
ULPI_bus.D5: P5.6 U7.19(DATA[5]) ; port ULPI_bus.D5
ULPI_bus.D6: P5.7 U7.18(DATA[6]) ; port ULPI_bus.D6
ULPI_bus.D7: P5.8 U7.17(DATA[7]) ; port ULPI_bus.D7
ULPI_bus.DIR: P5.11 U7.12(DIR) ; port ULPI_bus.DIR
ULPI_bus.NXT: P5.12 U7.11(NXT) ; port ULPI_bus.NXT
ULPI_bus.RESET: P5.13 U7.9(RESET) ; port ULPI_bus.RESET
ULPI_bus.STP: P5.10 U7.13(STP) ; port ULPI_bus.STP
USB2_HS.D_N: U7.8(DM) ; port USB2_HS.D_N
USB2_HS.D_P: U7.7(DP) ; port USB2_HS.D_P
USB3300_1V8: C32.2 C33.2 U7.15(VDD1.8) U7.26(VDD1.8)
USB3300_A1V8: C34.2 C35.2 U7.29(VDDA1.8)
NetC29_2: C29.2 P6.1 ; port USB2_HS.VBUS
NetC31_2: C31.2 OSC2.3(OUT) U7.28(XI)
Netnt0_0: nt0.0 ; port USB2_HS.GND
NetP6_2: P6.2 R45.1
NetR45_2: R45.2 U7.4(VBUS)
NetR46_1: R46.1 U7.32(RBIAS)

Not connected (* = marked no-connect by the designer): OSC2 1(E/D); U7 3(CPEN)* 5(ID)* 10(EXTVBUS)* 27(XO)

### Layout directives
differential pair: USB2_HS.D_N, USB2_HS.D_P

### Notes on the sheet
- Convention is to ground on host-side only.
  ID is floating in peripheral mode
- EP = ground pad
- 1V8 not connected to A1V8 because the internal regulators are used.
- REG_EN must have 3V3 to enable 1V8 regulators
- USB3300 - Silicon Labs USB 2.0 High speed tranceiver
  - Connected in peripheral mode
- Board:
- Version:
- Sheetname:
- Subject:
- Group:
- Sheet
- of
- Shematic file:

### Library data of the parts
C29 = CMP-1035-02736-1: CAP 1uF 16V ±5% 0603 (1608 Metric) Thickness 1mm SMD; Case-Metric: 1608; Case-EIA: 0603; Tolerance: Â±5%; Technology: SMT; Max Thickness: 1 mm; Rated Voltage: 16 V
C30 = CMP-1035-02309-1: CAP 10nF 16V ±1% 0603 (1608 Metric) Thickness 1mm SMD; Case-Metric: 1608; Tolerance: Â±1%; Case-EIA: 0603; Rated Voltage: 16 V; Technology: SMT; Max Thickness: 1 mm
C31 = CMP-1035-00665-1: CAP 15pF 16V ±0.25pF 0603 (1608 Metric) Thickness 1mm SMD; Case-Metric: 1608; Case-EIA: 0603; Tolerance: Â±0.25pF; Technology: SMT; Max Thickness: 1 mm; Rated Voltage: 16 V
C32 C35-C39 = CMP-1035-02583-1: as C17 on sheet N25Q128A13ESE40; Rated Voltage: 16 V; Max Thickness: 1 mm; Technology: SMT
C33 C34 = CMP-1035-02788-1: CAP 4.7uF 16V ±10% 0603 (1608 Metric) Thickness 1mm SMD; Case-Metric: 1608; Tolerance: Â±10%; Case-EIA: 0603; Technology: SMT; Rated Voltage: 16 V; Max Thickness: 1 mm
nt0 = net tie: used to connect nets without transferring net name
P5 = CMP-1024-00062-1: Manufacturer: Samtec; Pitch: 2.54 mm; Temperature Range: -55 to 125 degC; ComponentLink1URL: http://www.samtec.com; RoHS: True; PartNumber: HTSW-107-42-F-D; ComponentLink3Description: Package Specification; ComponentLink3URL: http://www.samtec.com/documents/webfiles/cpdf/HTSW-XXX-XX-XXX-X-XX-XX-XX-MKT.pdf; DatasheetVersion: F-214; Mounting Technology: Through-hole; PackageReference: HTSW-107-42-X-D; ComponentLink1Description: Manufacturer URL; PackageDescription: .025 SQ Post Hi-Temp Terminal Strip Assembly; ComponentLink2URL: http://www.samtec.com/documents/webfiles/pdf/HTSW_TH.PDF; Orientation: Vertical; PackageVersion: BO, 2/1987; ComponentLink2Description: Datasheet
P6 = CMP-1024-00330-1: 0.025" SQ Post Header, Through-hole, Vertical, -55 to 125 degC, 2.54 mm Pitch, 2-Pin, Male, RoHS; Manufacturer: Samtec; Pitch: 2.54 mm; DatasheetVersion: F-214; PackageReference: TSW-102-26-XX-S; ComponentLink3Description: Package Specification; PackageDescription: .025[0.64] SQ. Post Terminal Strip Assembly; PackageVersion: DM, 8/1988; ComponentLink1Description: Manufacturer URL; ComponentLink2URL: http://www.samtec.com/documents/webfiles/pdf/TSW_TH.PDF; ComponentLink3URL: http://www.samtec.com/documents/webfiles/cpdf/TSW-XXX-XX-XXX-X-XX-XXX-MKT.pdf; ComponentLink2Description: Datasheet; Temperature Range: -55 to 125 degC; Mounting Technology: Through-hole; ComponentLink1URL: http://www.samtec.com; RoHS: True; PartNumber: TSW-102-26-L-S; Orientation: Vertical
R45 = CMP-1012-00072-1: 820R 0.1W 5% 0603 (1608 Metric)  SMD; Case-EIA: 0603; Case-Metric: 1608; Tolerance: 5 %; Power: 0.1 W; Technology: SMT
R46 = CMP-1012-00631-1: 12K 0.1W 1% 0603 (1608 Metric)  SMD; Case-EIA: 0603; Case-Metric: 1608; Technology: SMT; Power: 0.1 W
U7 = CMP-0186-00339-1: Hi-Speed USB Host, Device or OTG PHY with ULPI Low Pin Interface, 5 pF, -40 to 85 degC, 32-Pin QFN (QFN-3304), RoHS, Tape and Reel; CI: 5 pF; ComponentLink3URL: http://ww1.microchip.com/downloads/en/DeviceDoc/8710a.pdf; DatasheetVersion: DS00001783B; Code_JEDEC: MO-220; Mounting Technology: Surface Mount; ComponentLink2URL: http://ww1.microchip.com/downloads/en/DeviceDoc/00001783B.pdf; Temperature Min: -40 degC; Temperature Max: 85 degC; ComponentLink2Description: Datasheet; RoHS: TRUE; PackageVersion: Rev. H, 07/2004; Generic Part Number: USB3300; ComponentLink1URL: http://www.microchip.com/; PackageDescription: 32-Pin Quad Flat Non-Leaded Package, Body 5 x 5 mm, Pitch 0.5 mm; ComponentLink3Description: Package Specification; ComponentLink1Description: Manufacturer URL; Packing: Tape and Reel; PartNumber: USB3300-EZK-TR
OSC2 = FXO-H736R-24: Supplier 1: Digi-Key; Supplier Part Number 1: 631-1185-1-ND

## Sheet LED.SchDoc
size A4; DocumentNumber: 3; SheetNumber: 3; SheetTotal: 21; SheetName: Debug LEDs
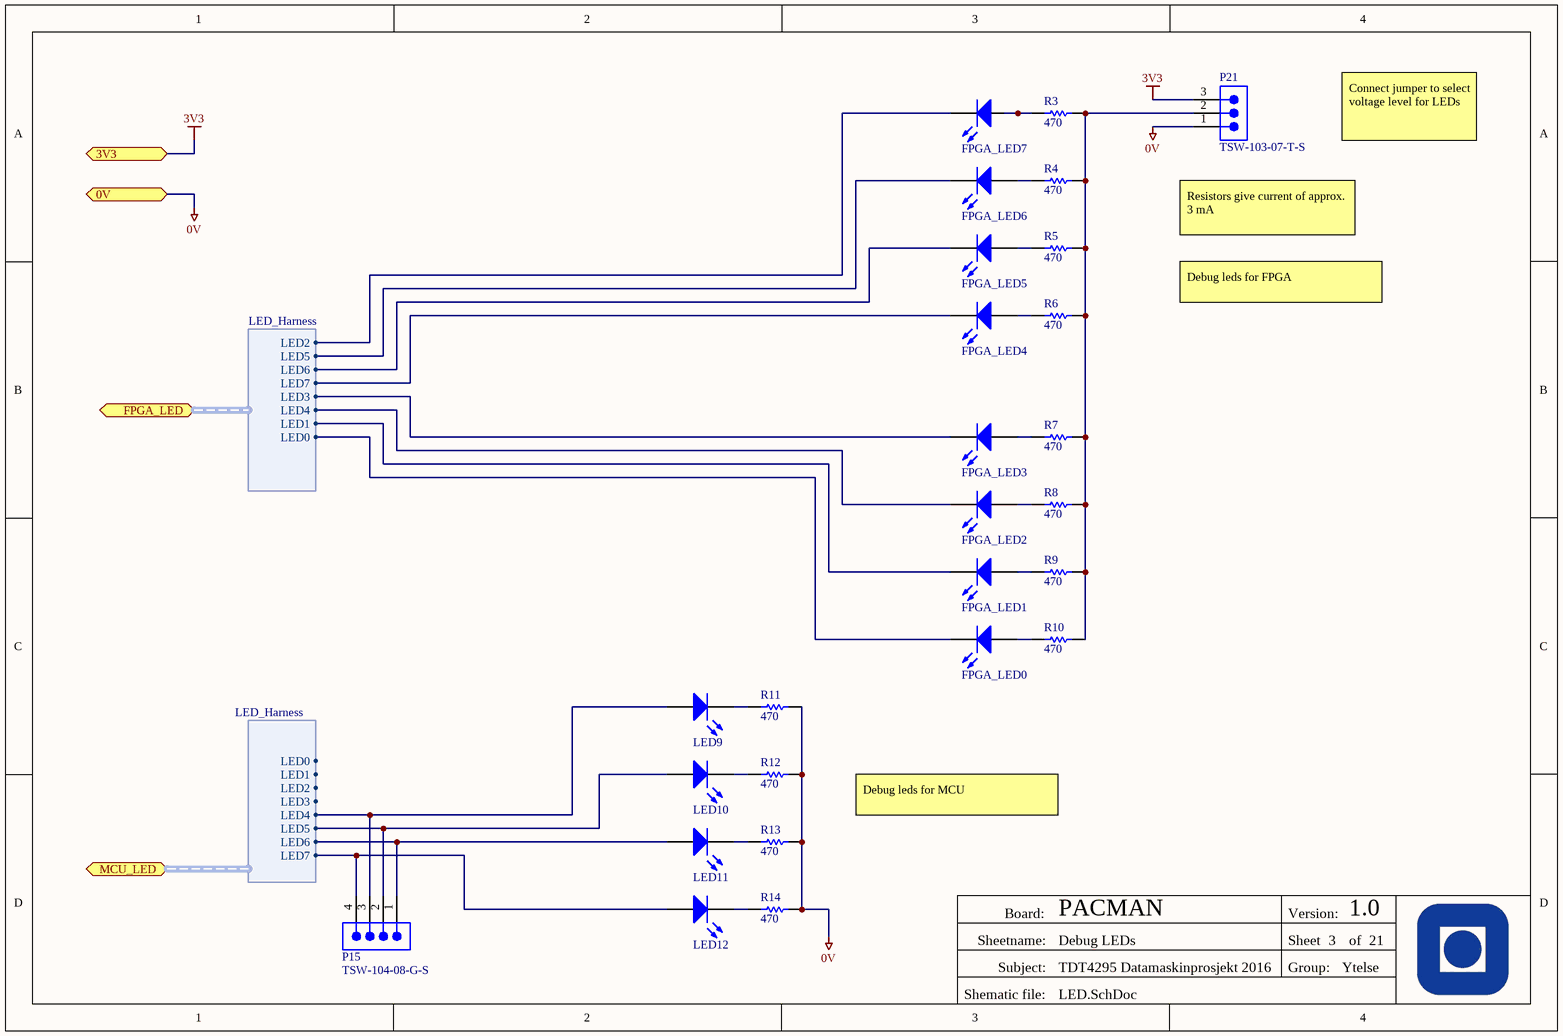
[diagram p17: LED.SchDoc]

### Parts
FPGA_LED0  150060RS75000  [0603_A]  (value not drawn)
FPGA_LED1  150060RS75000  [0603_A]  (value not drawn)
FPGA_LED2  150060RS75000  [0603_A]  (value not drawn)
FPGA_LED3  150060RS75000  [0603_A]  (value not drawn)
FPGA_LED4  150060RS75000  [0603_A]  (value not drawn)
FPGA_LED5  150060RS75000  [0603_A]  (value not drawn)
FPGA_LED6  150060RS75000  [0603_A]  (value not drawn)
FPGA_LED7  150060RS75000  [0603_A]  (value not drawn)
LED9  150060RS75000  [0603_A]  (value not drawn)
LED10  150060RS75000  [0603_A]  (value not drawn)
LED11  150060RS75000  [0603_A]  (value not drawn)
LED12  150060RS75000  [0603_A]  (value not drawn)
P15  TSW-104-08-G-S  [SMTC-TSW-104-08-X-S]
P21  TSW-103-07-T-S  [SMTC-TSW-103-07-X-S]
R3  value 470  [RESC0603(1608)_N]  (hidden comment: 470R 5% 0603(1608))
R4  value 470  [RESC0603(1608)_N]  (hidden comment: 470R 5% 0603(1608))
R5  value 470  [RESC0603(1608)_N]  (hidden comment: 470R 5% 0603(1608))
R6  value 470  [RESC0603(1608)_N]  (hidden comment: 470R 5% 0603(1608))
R7  value 470  [RESC0603(1608)_N]  (hidden comment: 470R 5% 0603(1608))
R8  value 470  [RESC0603(1608)_N]  (hidden comment: 470R 5% 0603(1608))
R9  value 470  [RESC0603(1608)_N]  (hidden comment: 470R 5% 0603(1608))
R10  value 470  [RESC0603(1608)_N]  (hidden comment: 470R 5% 0603(1608))
R11  value 470  [RESC0603(1608)_N]  (hidden comment: 470R 5% 0603(1608))
R12  value 470  [RESC0603(1608)_N]  (hidden comment: 470R 5% 0603(1608))
R13  value 470  [RESC0603(1608)_N]  (hidden comment: 470R 5% 0603(1608))
R14  value 470  [RESC0603(1608)_N]  (hidden comment: 470R 5% 0603(1608))

### Ports
0V, 3V3, FPGA_LED (harness LED_Harness), MCU_LED (harness LED_Harness)

### Harnesses
LED_Harness: LED0, LED1, LED2, LED3, LED4, LED5, LED6, LED7
LED_Harness: LED1, LED2, LED3, LED4, LED5, LED6, LED7, LED0

### Nets
0V: P21.1 R11.2 R12.2 R13.2 R14.2 ; port 0V
3V3: P21.3 ; port 3V3
NetFPGA_LED0_1: FPGA_LED0.1(K) ; port FPGA_LED.LED0
NetFPGA_LED0_2: FPGA_LED0.2(A) R10.1
NetFPGA_LED1_1: FPGA_LED1.1(K) ; port FPGA_LED.LED1
NetFPGA_LED1_2: FPGA_LED1.2(A) R9.1
NetFPGA_LED2_1: FPGA_LED2.1(K) ; port FPGA_LED.LED4
NetFPGA_LED2_2: FPGA_LED2.2(A) R8.1
NetFPGA_LED3_1: FPGA_LED3.1(K) ; port FPGA_LED.LED3
NetFPGA_LED3_2: FPGA_LED3.2(A) R7.1
NetFPGA_LED4_1: FPGA_LED4.1(K) ; port FPGA_LED.LED7
NetFPGA_LED4_2: FPGA_LED4.2(A) R6.1
NetFPGA_LED5_1: FPGA_LED5.1(K) ; port FPGA_LED.LED6
NetFPGA_LED5_2: FPGA_LED5.2(A) R5.1
NetFPGA_LED6_1: FPGA_LED6.1(K) ; port FPGA_LED.LED5
NetFPGA_LED6_2: FPGA_LED6.2(A) R4.1
NetFPGA_LED7_1: FPGA_LED7.1(K) ; port FPGA_LED.LED2
NetFPGA_LED7_2: FPGA_LED7.2(A) R3.1
NetLED9_1: LED9.1(K) R11.1
NetLED9_2: LED9.2(A) P15.3 ; port MCU_LED.LED4
NetLED10_1: LED10.1(K) R12.1
NetLED10_2: LED10.2(A) P15.2 ; port MCU_LED.LED5
NetLED11_1: LED11.1(K) R13.1
NetLED11_2: LED11.2(A) P15.1 ; port MCU_LED.LED6
NetLED12_1: LED12.1(K) R14.1
NetLED12_2: LED12.2(A) P15.4 ; port MCU_LED.LED7
NetP21_2: P21.2 R3.2 R4.2 R5.2 R6.2 R7.2 R8.2 R9.2 R10.2

### Notes on the sheet
- Connect jumper to select voltage level for LEDs
- Resistors give current of approx. 3 mA
- Debug leds for FPGA
- Debug leds for MCU
- Board:
- Version:
- Sheetname:
- Subject:
- Group:
- Sheet
- of
- Shematic file:

### Library data of the parts
FPGA_LED0-FPGA_LED7 LED9-LED12 = CMP-1426-00001-1: SMD mono-color Chip LED, WL-SMCW, Red; Manufacturer: Wuerth Elektronik; Color: Red; PackageReference: 0603_A; ComponentLink2URL: http://katalog.we-online.com/led/datasheet/150060RS75000.pdf; ComponentLink1URL: http://www.we-online.com; ComponentLink1Description: Manufacturer URL; ComponentLink2Description: Datasheet; PartNumber: 150060RS75000
P15 = CMP-1024-00357-1: 0.025" SQ Post Header, Through-hole, Vertical, -55 to 125 degC, 2.54 mm Pitch, 4-Pin, Male, RoHS; Manufacturer: Samtec; Pitch: 2.54 mm; RoHS: True; ComponentLink3URL: http://www.samtec.com/documents/webfiles/cpdf/TSW-XXX-XX-XXX-X-XX-XXX-MKT.pdf; Mounting Technology: Through-hole; ComponentLink2URL: http://www.samtec.com/documents/webfiles/pdf/TSW_TH.PDF; ComponentLink1URL: http://www.samtec.com; ComponentLink3Description: Package Specification; PackageVersion: DM, 8/1988; ComponentLink2Description: Datasheet; PackageReference: TSW-104-08-X-S; PackageDescription: .025[0.64] SQ. Post Terminal Strip Assembly; PartNumber: TSW-104-08-G-S; ComponentLink1Description: Manufacturer URL; Temperature Range: -55 to 125 degC; DatasheetVersion: F-214; Orientation: Vertical
P21 = CMP-1024-00332-1: Manufacturer: Samtec; Pitch: 2.54 mm; ComponentLink1URL: http://www.samtec.com; ComponentLink3URL: http://www.samtec.com/documents/webfiles/cpdf/TSW-XXX-XX-XXX-X-XX-XXX-MKT.pdf; PartNumber: TSW-103-07-T-S; Mounting Technology: Through-hole; RoHS: True; DatasheetVersion: F-214; PackageVersion: DM, 8/1988; Temperature Range: -55 to 105 degC; ComponentLink2Description: Datasheet; ComponentLink1Description: Manufacturer URL; Orientation: Vertical; PackageReference: TSW-103-07-X-S; ComponentLink3Description: Package Specification; ComponentLink2URL: http://www.samtec.com/documents/webfiles/pdf/TSW_TH.PDF; PackageDescription: .025[0.64] SQ. Post Terminal Strip Assembly
R3-R14 = CMP-1012-00066-1: 470R 0.1W 5% 0603 (1608 Metric)  SMD; Case-Metric: 1608; Case-EIA: 0603; Tolerance: 5 %; Technology: SMT; Power: 0.1 W

## Sheet Connectors.SchDoc
size A4; DocumentNumber: 2; SheetNumber: 2; SheetTotal: 21; SheetName: Connectors
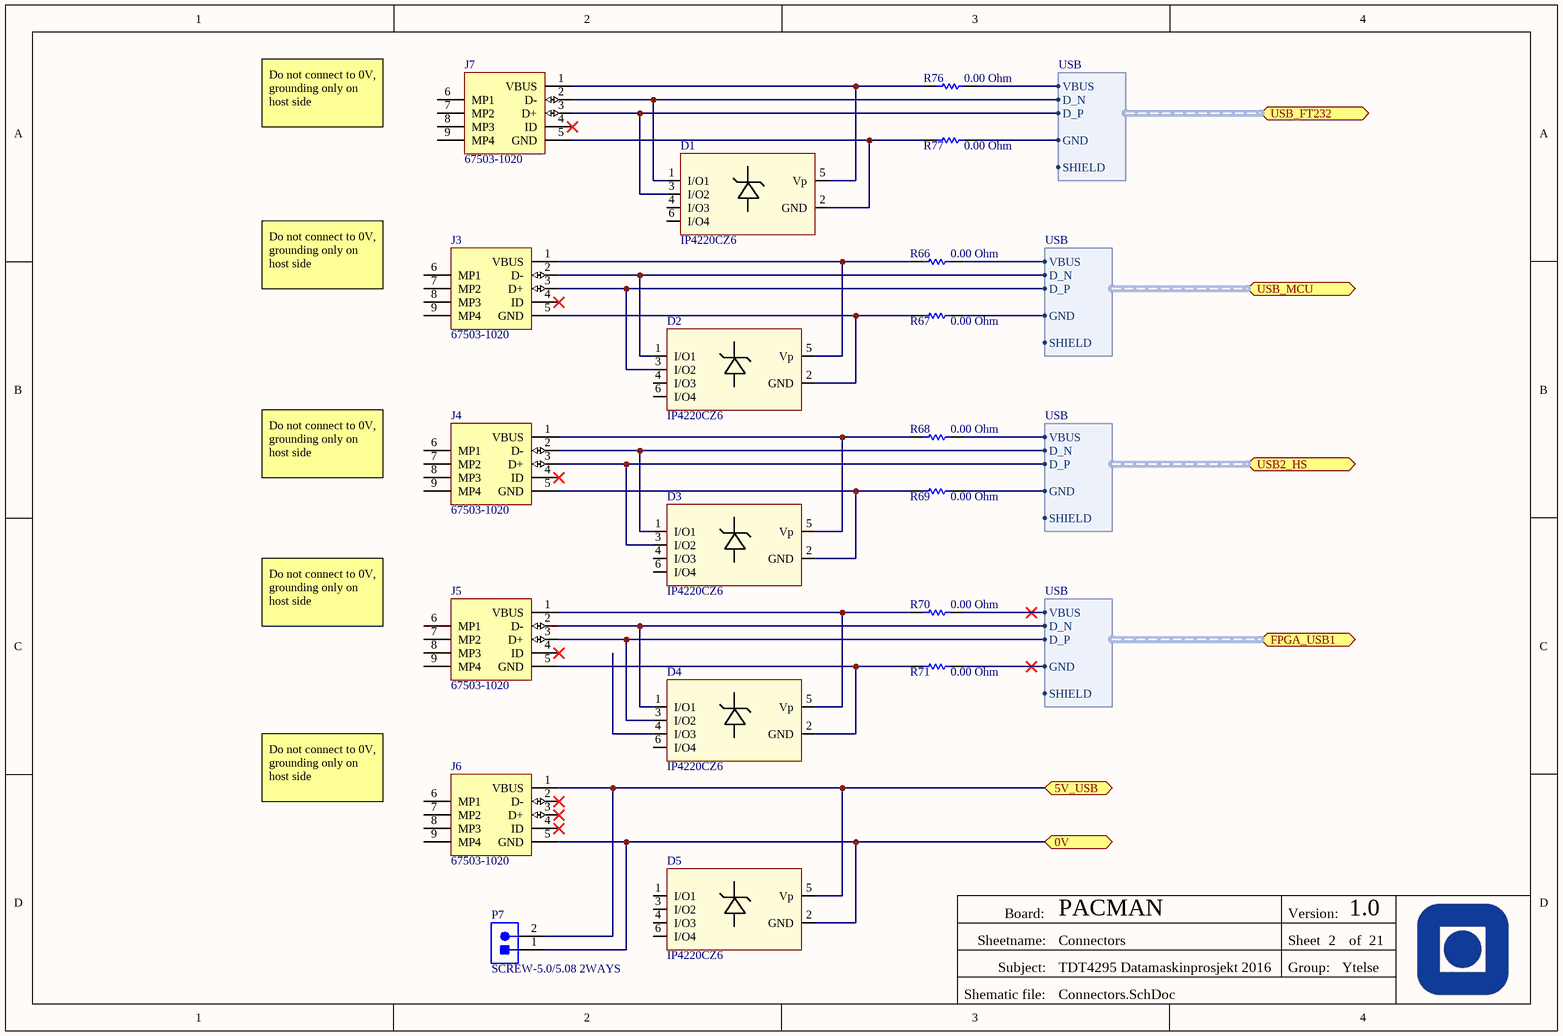
[diagram p18: Connectors.SchDoc]

### Parts
D1  IP4220CZ6  [NXP SOT457]
D2  IP4220CZ6  [NXP SOT457]
D3  IP4220CZ6  [NXP SOT457]
D4  IP4220CZ6  [NXP SOT457]
D5  IP4220CZ6  [NXP SOT457]
J3  67503-1020  [MOLX-67503-1020_V]
J4  67503-1020  [MOLX-67503-1020_V]
J5  67503-1020  [MOLX-67503-1020_V]
J6  67503-1020  [MOLX-67503-1020_V]
J7  67503-1020  [MOLX-67503-1020_V]
P7  SCREW-5.0/5.08 2WAYS  [SCREW-5.0-2WAYS_V]
R66  value 0.00 Ohm  [RESC0603(1608)_N]  (hidden comment: Jumper 0603(1608))
R67  value 0.00 Ohm  [RESC0603(1608)_N]  (hidden comment: Jumper 0603(1608))
R68  value 0.00 Ohm  [RESC0603(1608)_N]  (hidden comment: Jumper 0603(1608))
R69  value 0.00 Ohm  [RESC0603(1608)_N]  (hidden comment: Jumper 0603(1608))
R70  value 0.00 Ohm  [RESC0603(1608)_N]  (hidden comment: Jumper 0603(1608))
R71  value 0.00 Ohm  [RESC0603(1608)_N]  (hidden comment: Jumper 0603(1608))
R76  value 0.00 Ohm  [RESC0603(1608)_N]  (hidden comment: Jumper 0603(1608))
R77  value 0.00 Ohm  [RESC0603(1608)_N]  (hidden comment: Jumper 0603(1608))

### Ports
0V, 5V_USB, FPGA_USB1 (harness USB), USB2_HS (harness USB), USB_FT232 (harness USB), USB_MCU (harness USB)

### Harnesses
USB: D_P, D_N, VBUS, GND, SHIELD

### Nets
0V: D5.2(GND) J6.5(GND) P7.1 ; port 0V
5V_USB: D5.5(Vp) J6.1(VBUS) P7.2 ; port 5V_USB
FPGA_USB1.D_N: D4.1(I/O1) J5.2(D-) ; port FPGA_USB1.D_N
FPGA_USB1.D_P: D4.3(I/O2) J5.3(D+) ; port FPGA_USB1.D_P
USB2_HS.D_N: D3.1(I/O1) J4.2(D-) ; port USB2_HS.D_N
USB2_HS.D_P: D3.3(I/O2) J4.3(D+) ; port USB2_HS.D_P
USB_FT232.D_N: D1.1(I/O1) J7.2(D-) ; port USB_FT232.D_N
USB_FT232.D_P: D1.3(I/O2) J7.3(D+) ; port USB_FT232.D_P
NetC5_2: R66.2 ; port USB_MCU.VBUS
NetC29_2: R68.2 ; port USB2_HS.VBUS
NetC91_2: R76.2 ; port USB_FT232.VBUS
NetD1_2: D1.2(GND) J7.5(GND) R77.1
NetD1_5: D1.5(Vp) J7.1(VBUS) R76.1
NetD2_1: D2.1(I/O1) J3.2(D-) ; port USB_MCU.D_N
NetD2_2: D2.2(GND) J3.5(GND) R67.1
NetD2_3: D2.3(I/O2) J3.3(D+) ; port USB_MCU.D_P
NetD2_5: D2.5(Vp) J3.1(VBUS) R66.1
NetD3_2: D3.2(GND) J4.5(GND) R69.1
NetD3_5: D3.5(Vp) J4.1(VBUS) R68.1
NetD4_2: D4.2(GND) J5.5(GND) R71.1
NetD4_5: D4.5(Vp) J5.1(VBUS) R70.1
Netnt0_0: R69.2 ; port USB2_HS.GND
Netnt1_0: R67.2 ; port USB_MCU.GND
Netnt2_0: R77.2 ; port USB_FT232.GND
NetR70_2: R70.2 ; port FPGA_USB1.VBUS
NetR71_2: R71.2 ; port FPGA_USB1.GND

Not connected (* = marked no-connect by the designer): D1 4(I/O3) 6(I/O4); D2 4(I/O3) 6(I/O4); D3 4(I/O3) 6(I/O4); D4 4(I/O3) 6(I/O4); D5 1(I/O1) 3(I/O2) 4(I/O3) 6(I/O4); J3 4(ID)* 6(MP1) 7(MP2) 8(MP3) 9(MP4); J4 4(ID)* 6(MP1) 7(MP2) 8(MP3) 9(MP4); J5 4(ID)* 6(MP1) 7(MP2) 8(MP3) 9(MP4); J6 2(D-)* 3(D+)* 4(ID)* 6(MP1) 7(MP2) 8(MP3) 9(MP4); J7 4(ID)* 6(MP1) 7(MP2) 8(MP3) 9(MP4)

### Notes on the sheet
- Do not connect to 0V, grounding only on host side
- Board:
- Version:
- Sheetname:
- Subject:
- Group:
- Sheet
- of
- Shematic file:

### Library data of the parts
D1-D5 = IP4220CZ6: 4 channel USB ESD protection device; Supplier 1: Digi-Key; Supplier Part Number 1: 568-3529-2-ND
J3-J7 = CMP-0411-00002-1: USB, MINI, SMD, RA KME04-USBMU03A01; Manufacturer: Molex; ComponentLink1URL: http://www.molex.com/; PartNumber: 67503-1020; Mounting Technology: Surface Mount; ComponentLink1Description: Manufacturer URL; Terminal Pitch: 0.8 mm; DatasheetVersion: Rev F, 06/2009; ComponentLink2Description: Datasheet; PackageDescription: Mini USB Connector, SMT, Righer Angle; ComponentLink2URL: http://www.molex.com/pdm_docs/sd/675031020_sd.pdf; PackageReference: 67503-1020
P7 = CMP-0617-00009-1: Socket, Screw Terminal Block, 2 Way, 5.0 mm Pitch, 90 Degree Angle, Through-Hole; Manufacturer: No Vendor; Insulation Resistance: 5000 MOhm / 1000 V; Contact Resistance: 20 mOhm; Rated Current: 25 A; Poles: 2; Rated Voltage: 300 V; PartNumber: SCREW-5.0/5.08 2WAYS; ComponentLink1Description: Datasheet; ComponentLink1URL: 5mm screw terminal in SVN; Mounting Technology: Through Hole; PackageDescription: Socket, Screw Terminal Block, 2 Way, Pitch 5 mm, 90 Degree Angle, Through-Hole; Temperature Range: -40 to 105 degC
R66-R71 R76 R77 = CMP-1012-00001-1: Jumper 0603 (1608 Metric); Case-Metric: 1608; Power: None; Case-EIA: 0603; Technology: SMT; Tolerance: None

## Sheet USB_trans.SchDoc
size A4; DocumentNumber: 11; SheetNumber: 11; SheetTotal: 21; SheetName: USB Full Speed tranceiver
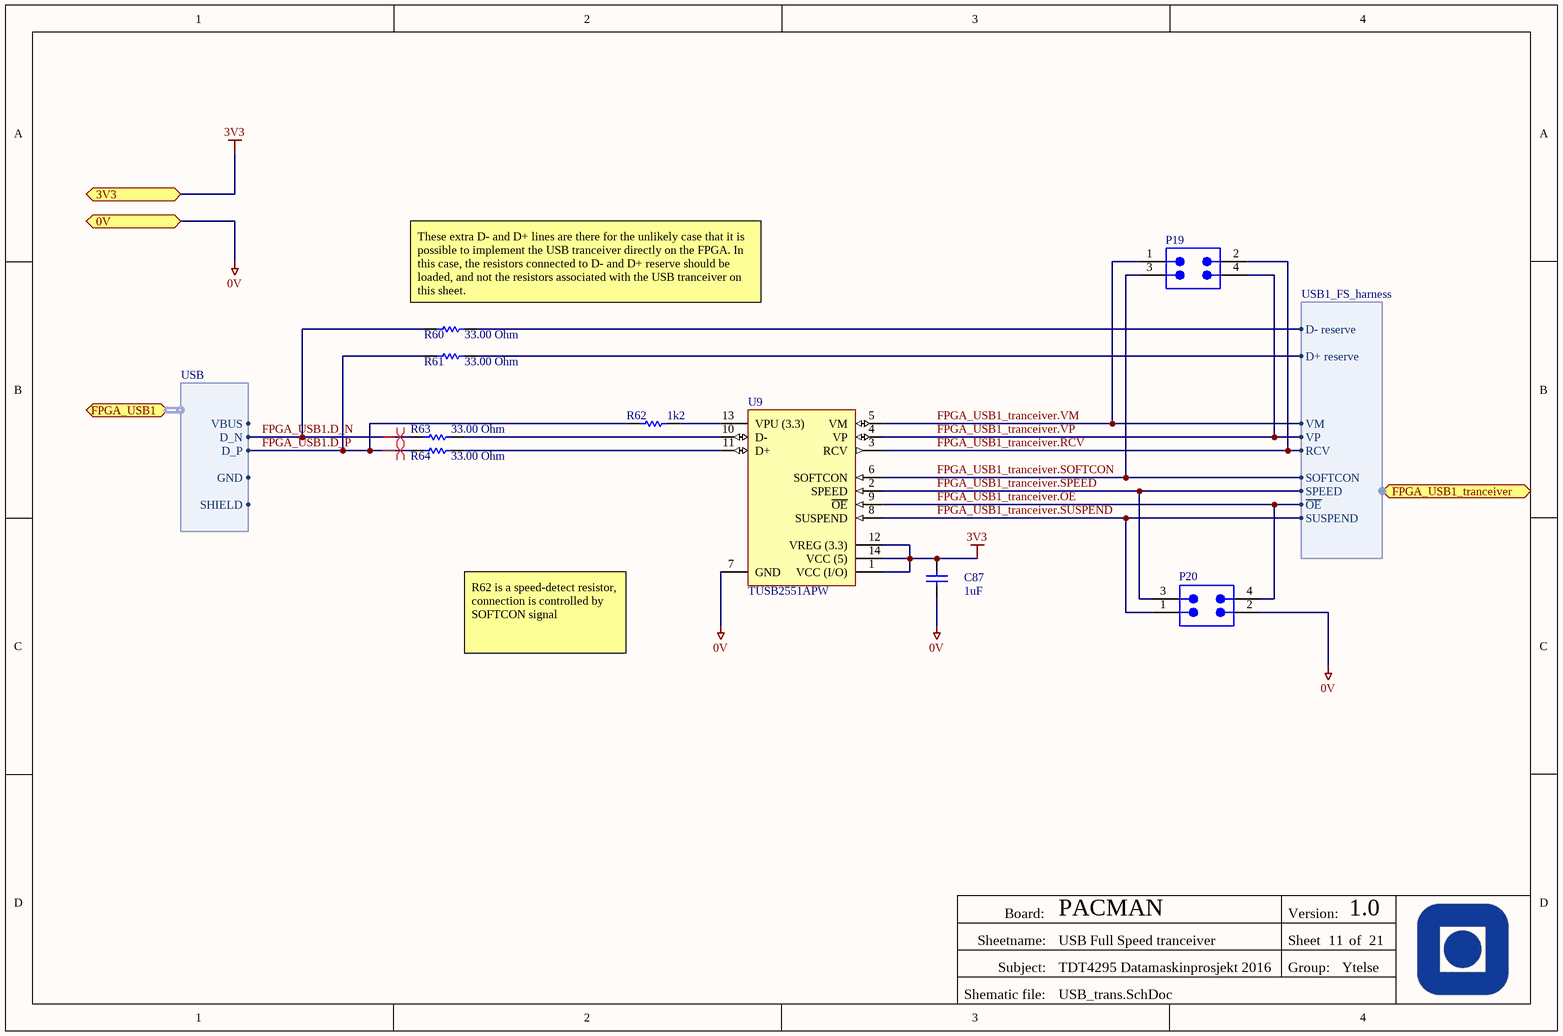
[diagram p19: USB_trans.SchDoc]

### Parts
C87  value 1uF  [CAPC0603(1608)100_N]  (hidden comment: CAP 1uF 16V 0603(1608))
P19  PH2542-4-SPGRH-6-3  [PCE-PH2542-4-SPGRH-6-3_V]  (value not drawn)
P20  PH2542-4-SPGRH-6-3  [PCE-PH2542-4-SPGRH-6-3_V]  (value not drawn)
R60  value 33.00 Ohm  [RESC0603(1608)_M]  (hidden comment: 33R 5% 0603(1608))
R61  value 33.00 Ohm  [RESC0603(1608)_M]  (hidden comment: 33R 5% 0603(1608))
R62  value 1k2  [RESC0603(1608)_M]  (hidden comment: 1K2 1% 0603(1608))
R63  value 33.00 Ohm  [RESC0603(1608)_M]  (hidden comment: 33R 5% 0603(1608))
R64  value 33.00 Ohm  [RESC0603(1608)_M]  (hidden comment: 33R 5% 0603(1608))
U9  TUSB2551APW  [PW14_N]

### Ports
0V, 3V3, FPGA_USB1 (harness USB), FPGA_USB1_tranceiver (harness USB1_FS_harness)

### Harnesses
USB1_FS_harness: VM, VP, RCV, SOFTCON, SPEED, ~{OE}, SUSPEND, D- reserve, D+ reserve
USB: D_P, D_N, VBUS, GND, SHIELD

### Nets
0V: C87.1 P20.2 U9.7(GND) ; port 0V
3V3: C87.2 U9.1(VCC_(I/O)) U9.12(VREG_(3.3)) U9.14(VCC_(5)) ; port 3V3
FPGA_USB1.D_N: R60.1 R63.1 ; port FPGA_USB1.D_N
FPGA_USB1.D_P: R61.1 R62.1 R64.1 ; port FPGA_USB1.D_P
FPGA_USB1_tranceiver.D+ reserve: R61.2 ; port FPGA_USB1_tranceiver.D+ reserve
FPGA_USB1_tranceiver.D- reserve: R60.2 ; port FPGA_USB1_tranceiver.D- reserve
FPGA_USB1_tranceiver.~{OE}: P20.4 U9.9(~{OE}) ; port FPGA_USB1_tranceiver.~{OE}
FPGA_USB1_tranceiver.RCV: P19.2 U9.3(RCV) ; port FPGA_USB1_tranceiver.RCV
FPGA_USB1_tranceiver.SOFTCON: P19.3 U9.6(SOFTCON) ; port FPGA_USB1_tranceiver.SOFTCON
FPGA_USB1_tranceiver.SPEED: P20.3 U9.2(SPEED) ; port FPGA_USB1_tranceiver.SPEED
FPGA_USB1_tranceiver.SUSPEND: P20.1 U9.8(SUSPEND) ; port FPGA_USB1_tranceiver.SUSPEND
FPGA_USB1_tranceiver.VM: P19.1 U9.5(VM) ; port FPGA_USB1_tranceiver.VM
FPGA_USB1_tranceiver.VP: P19.4 U9.4(VP) ; port FPGA_USB1_tranceiver.VP
NetR62_2: R62.2 U9.13(VPU_(3.3))
NetR63_2: R63.2 U9.10(D-)
NetR64_2: R64.2 U9.11(D+)

### Layout directives
differential pair: FPGA_USB1.D_N, FPGA_USB1.D_P

### Notes on the sheet
- (near R60) These extra D- and D+ lines are there for the unlikely case that it is possible to implement the USB tranceiver directly on the FPGA. In this case, the resistors connected to D- and D+ reserve should be loaded, and not the resistors associated with the USB tranceiver on this sheet.
- R62 is a speed-detect resistor, connection is controlled by SOFTCON signal
- Board:
- Version:
- Sheetname:
- Subject:
- Group:
- Sheet
- of
- Shematic file:

### Library data of the parts
C87 = CMP-1035-02736-1: as C29 on sheet USB3300; Technology: SMT; Max Thickness: 1 mm; Rated Voltage: 16 V
P19 P20 = CMP-0423-00002-1: Male Header, Pitch 2.54mm, 2x2 Position, Mated Height 6mm, Tail Length 3mm; Manufacturer: Pinchao Electronic; ComponentLink1Description: Manufacturer URL; Mounting Technology: Through Hole; PartNumber: PH2542-4-SPGRH-6-3; PackageDescription: Male Header, Pitch 2.54mm, 2x10 Position, Mated Height 6mm, Tail Length 3mm; PackageReference: PH2542-4-SPGRH-6-3; ComponentLink1URL: http://www.suzhoupinchao.com/; Terminal Pitch: 2.54 mm
R60 R61 R63 R64 = CMP-1012-00038-1: 33R 0.1W 5% 0603 (1608 Metric)  SMD; Case-EIA: 0603; Case-Metric: 1608; Tolerance: 5 %; Technology: SMT; Power: 0.1 W
R62 = CMP-1012-00518-1: 1K2 0.1W 1% 0603 (1608 Metric)  SMD; Case-EIA: 0603; Case-Metric: 1608; Power: 0.1 W; Technology: SMT; Tolerance: 1 %
U9 = CMP-0309-00089-1: Advanced USB Transceiver, Full Speed, Single, +/-15 KV, -40 to 85 degC, 14-Pin TSSOP (PW); Manufacturer: Texas Instruments; ComponentLink1Description: Datasheet; PackageDescription: 14-Pin Thin Small Outline Package 0.65 mm Pitch; PackageReference: PW14; USB Speed: Full; ComponentLink2Description: Package Specification; PackageVersion: revG, Feb-2011; SubFamily: USB Transceiver; DatasheetVersion: SCES790; PartNumber: TUSB2551APW; Code_JEDEC: MO-153; ESD HBM(kV): +/-15; ComponentLink1URL: http://www.ti.com/general/docs/lit/getliterature.tsp?genericPartNumber=TUSB2551A&fileType=pdf; ComponentLink2URL: http://www.ti.com/lit/ml/mpds360/mpds360.pdf; Mounting Technology: Surface Mount

## Sheet UART_connect.SchDoc
size A4; DocumentNumber: 10; SheetNumber: 10; SheetTotal: 21; SheetName: UART to USB Bridge
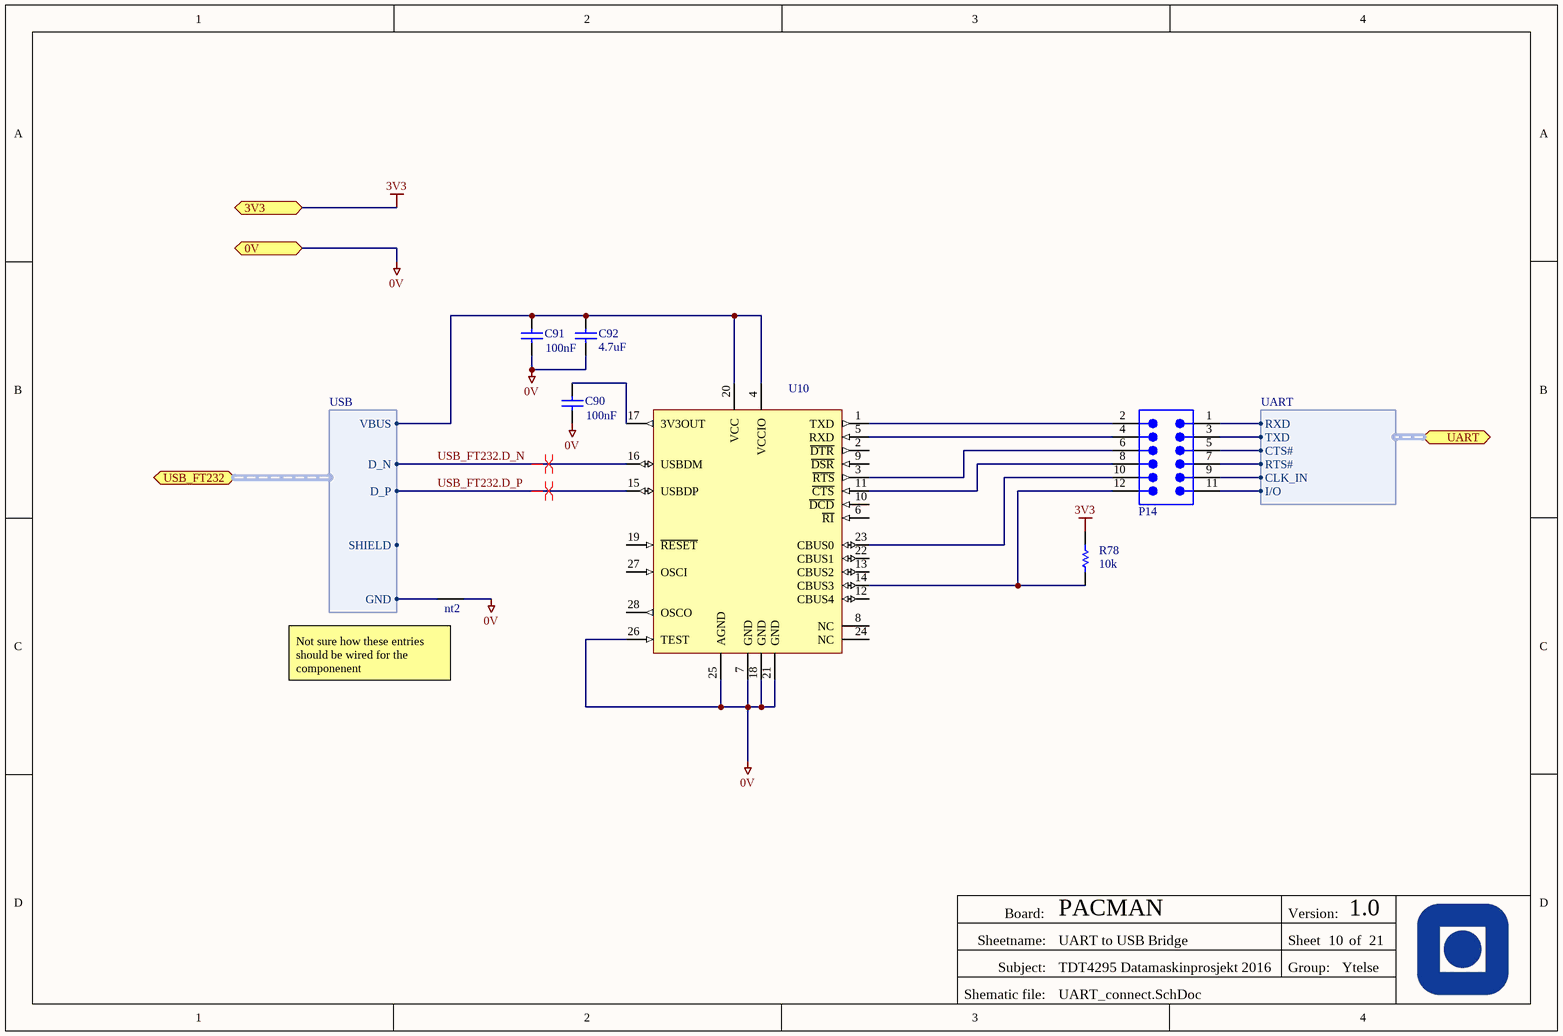
[diagram p20: UART_connect.SchDoc]

### Parts
C90  value 100nF  [CAPC0603(1608)100_M]  (hidden comment: CAP 100nF 16V 0603(1608))
C91  value 100nF  [CAPC0603(1608)100_M]  (hidden comment: CAP 100nF 16V 0603(1608))
C92  value 4.7uF  [CAPC0603(1608)100_M]  (hidden comment: CAP 4.7uF 16V 0603(1608))
nt2  net tie  [net tie]  (value not drawn)  (net tie, no BOM)
P14  TSW-106-07-T-D  [SMTC-TSW-106-07-X-D]  (value not drawn)
R78  value 10k  [RESC0603(1608)_N]  (hidden comment: 10K 1% 0603(1608))
U10  FT232RL-Reel  [SSOP-28_L]  (value not drawn)

### Ports
0V, 3V3, UART (harness UART), USB_FT232 (harness USB)

### Harnesses
UART: TXD, RXD, CTS#, RTS#, CLK_IN, I/O
USB: D_P, D_N, VBUS, GND, SHIELD

### Nets
0V: C90.1 C91.1 C92.1 nt2.1 U10.7(GND) U10.18(GND) U10.21(GND) U10.25(AGND) U10.26(TEST) ; port 0V
3V3: R78.2 ; port 3V3
UART.RXD: P14.1 ; port UART.RXD
UART.TXD: P14.3 ; port UART.TXD
USB_FT232.D_N: U10.16(USBDM) ; port USB_FT232.D_N
USB_FT232.D_P: U10.15(USBDP) ; port USB_FT232.D_P
NetC90_2: C90.2 U10.17(3V3OUT)
NetC91_2: C91.2 C92.2 U10.4(VCCIO) U10.20(VCC) ; port USB_FT232.VBUS
Netnt2_0: nt2.0 ; port USB_FT232.GND
NetP14_2: P14.2 U10.1(TXD)
NetP14_4: P14.4 U10.5(RXD)
NetP14_5: P14.5 ; port UART.CTS#
NetP14_6: P14.6 U10.3(~{RTS})
NetP14_7: P14.7 ; port UART.RTS#
NetP14_8: P14.8 U10.11(~{CTS})
NetP14_9: P14.9 ; port UART.CLK_IN
NetP14_10: P14.10 U10.23(CBUS0)
NetP14_11: P14.11 ; port UART.I/O
NetP14_12: P14.12 R78.1 U10.14(CBUS3)

Not connected (* = marked no-connect by the designer): U10 2(~{DTR}) 6(~{RI}) 8(NC) 9(~{DSR}) 10(~{DCD}) 12(CBUS4) 13(CBUS2) 19(~{RESET}) 22(CBUS1) 24(NC) 27(OSCI) 28(OSCO)

### Layout directives
differential pair: USB_FT232.D_N, USB_FT232.D_P

### Notes on the sheet
- (near nt2) Not sure how these entries should be wired for the componenent
- Board:
- Version:
- Sheetname:
- Subject:
- Group:
- Sheet
- of
- Shematic file:

### Library data of the parts
C90 C91 = CMP-1035-02583-1: as C17 on sheet N25Q128A13ESE40; Rated Voltage: 16 V; Max Thickness: 1 mm; Technology: SMT
C92 = CMP-1035-02788-1: as C33 on sheet USB3300; Technology: SMT; Rated Voltage: 16 V; Max Thickness: 1 mm
nt2 = net tie: as nt0 on sheet USB3300
P14 = CMP-1024-00380-1: Manufacturer: Samtec; Pitch: 2.54 mm; Orientation: Vertical; Mounting Technology: Through-hole; ComponentLink2URL: http://www.samtec.com/documents/webfiles/pdf/TSW_TH.PDF; Temperature Range: -55 to 105 degC; ComponentLink1URL: http://www.samtec.com; PackageReference: TSW-106-07-X-D; ComponentLink3Description: Package Specification; ComponentLink1Description: Manufacturer URL; PackageDescription: .025[0.64] SQ. Post Terminal Strip Assembly; PackageVersion: DM, 8/1988; ComponentLink2Description: Datasheet; ComponentLink3URL: http://www.samtec.com/documents/webfiles/cpdf/TSW-XXX-XX-XXX-X-XX-XXX-MKT.pdf; DatasheetVersion: F-214; RoHS: True; PartNumber: TSW-106-07-T-D
R78 = CMP-1012-00623-1: 10K 0.1W 1% 0603 (1608 Metric)  SMD; Case-EIA: 0603; Case-Metric: 1608; Power: 0.1 W; Tolerance: 1 %; Technology: SMT
U10 = CMP-0078-00029-1: USB UART Asynchronous Serial Data Transfer Chip, SSOP-28, Tape and Reel; DatasheetVersion: ver 2.07, Jul-2010; PackageDescription: 28-Pin Small Outline Package 0.65 mm Pitch; PackageVersion: 2010; PackageReference: SSOP-28